# EAGLE design cm3_audio (EAGLE 9.0.1)
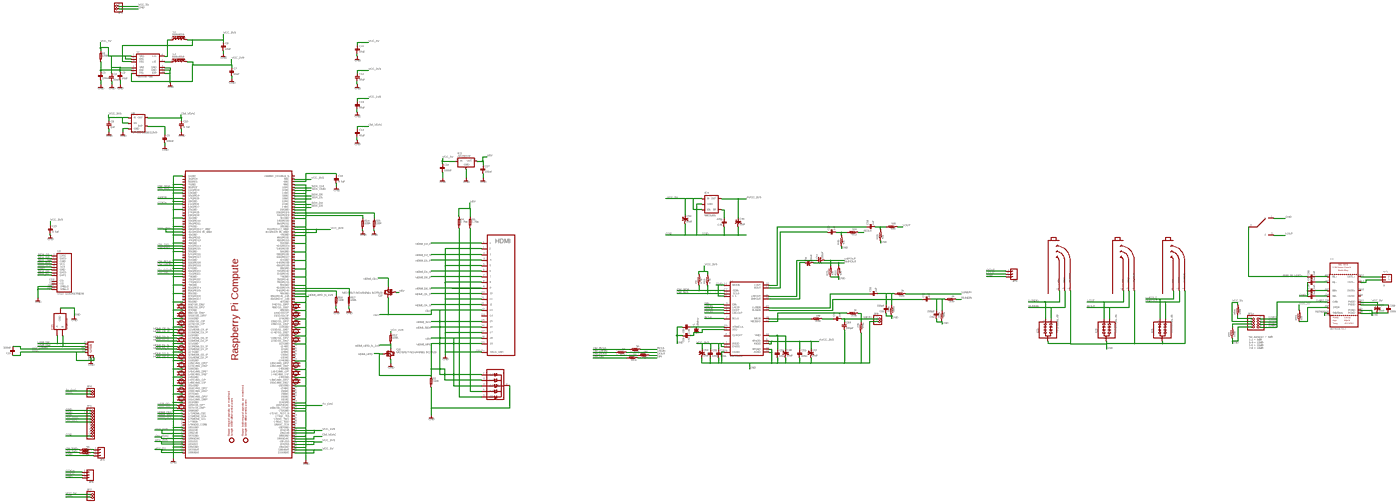
[diagram p0: schematic, sheet 1, overview]
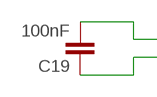
[diagram p1: schematic, sheet 1, part 1 of 4]
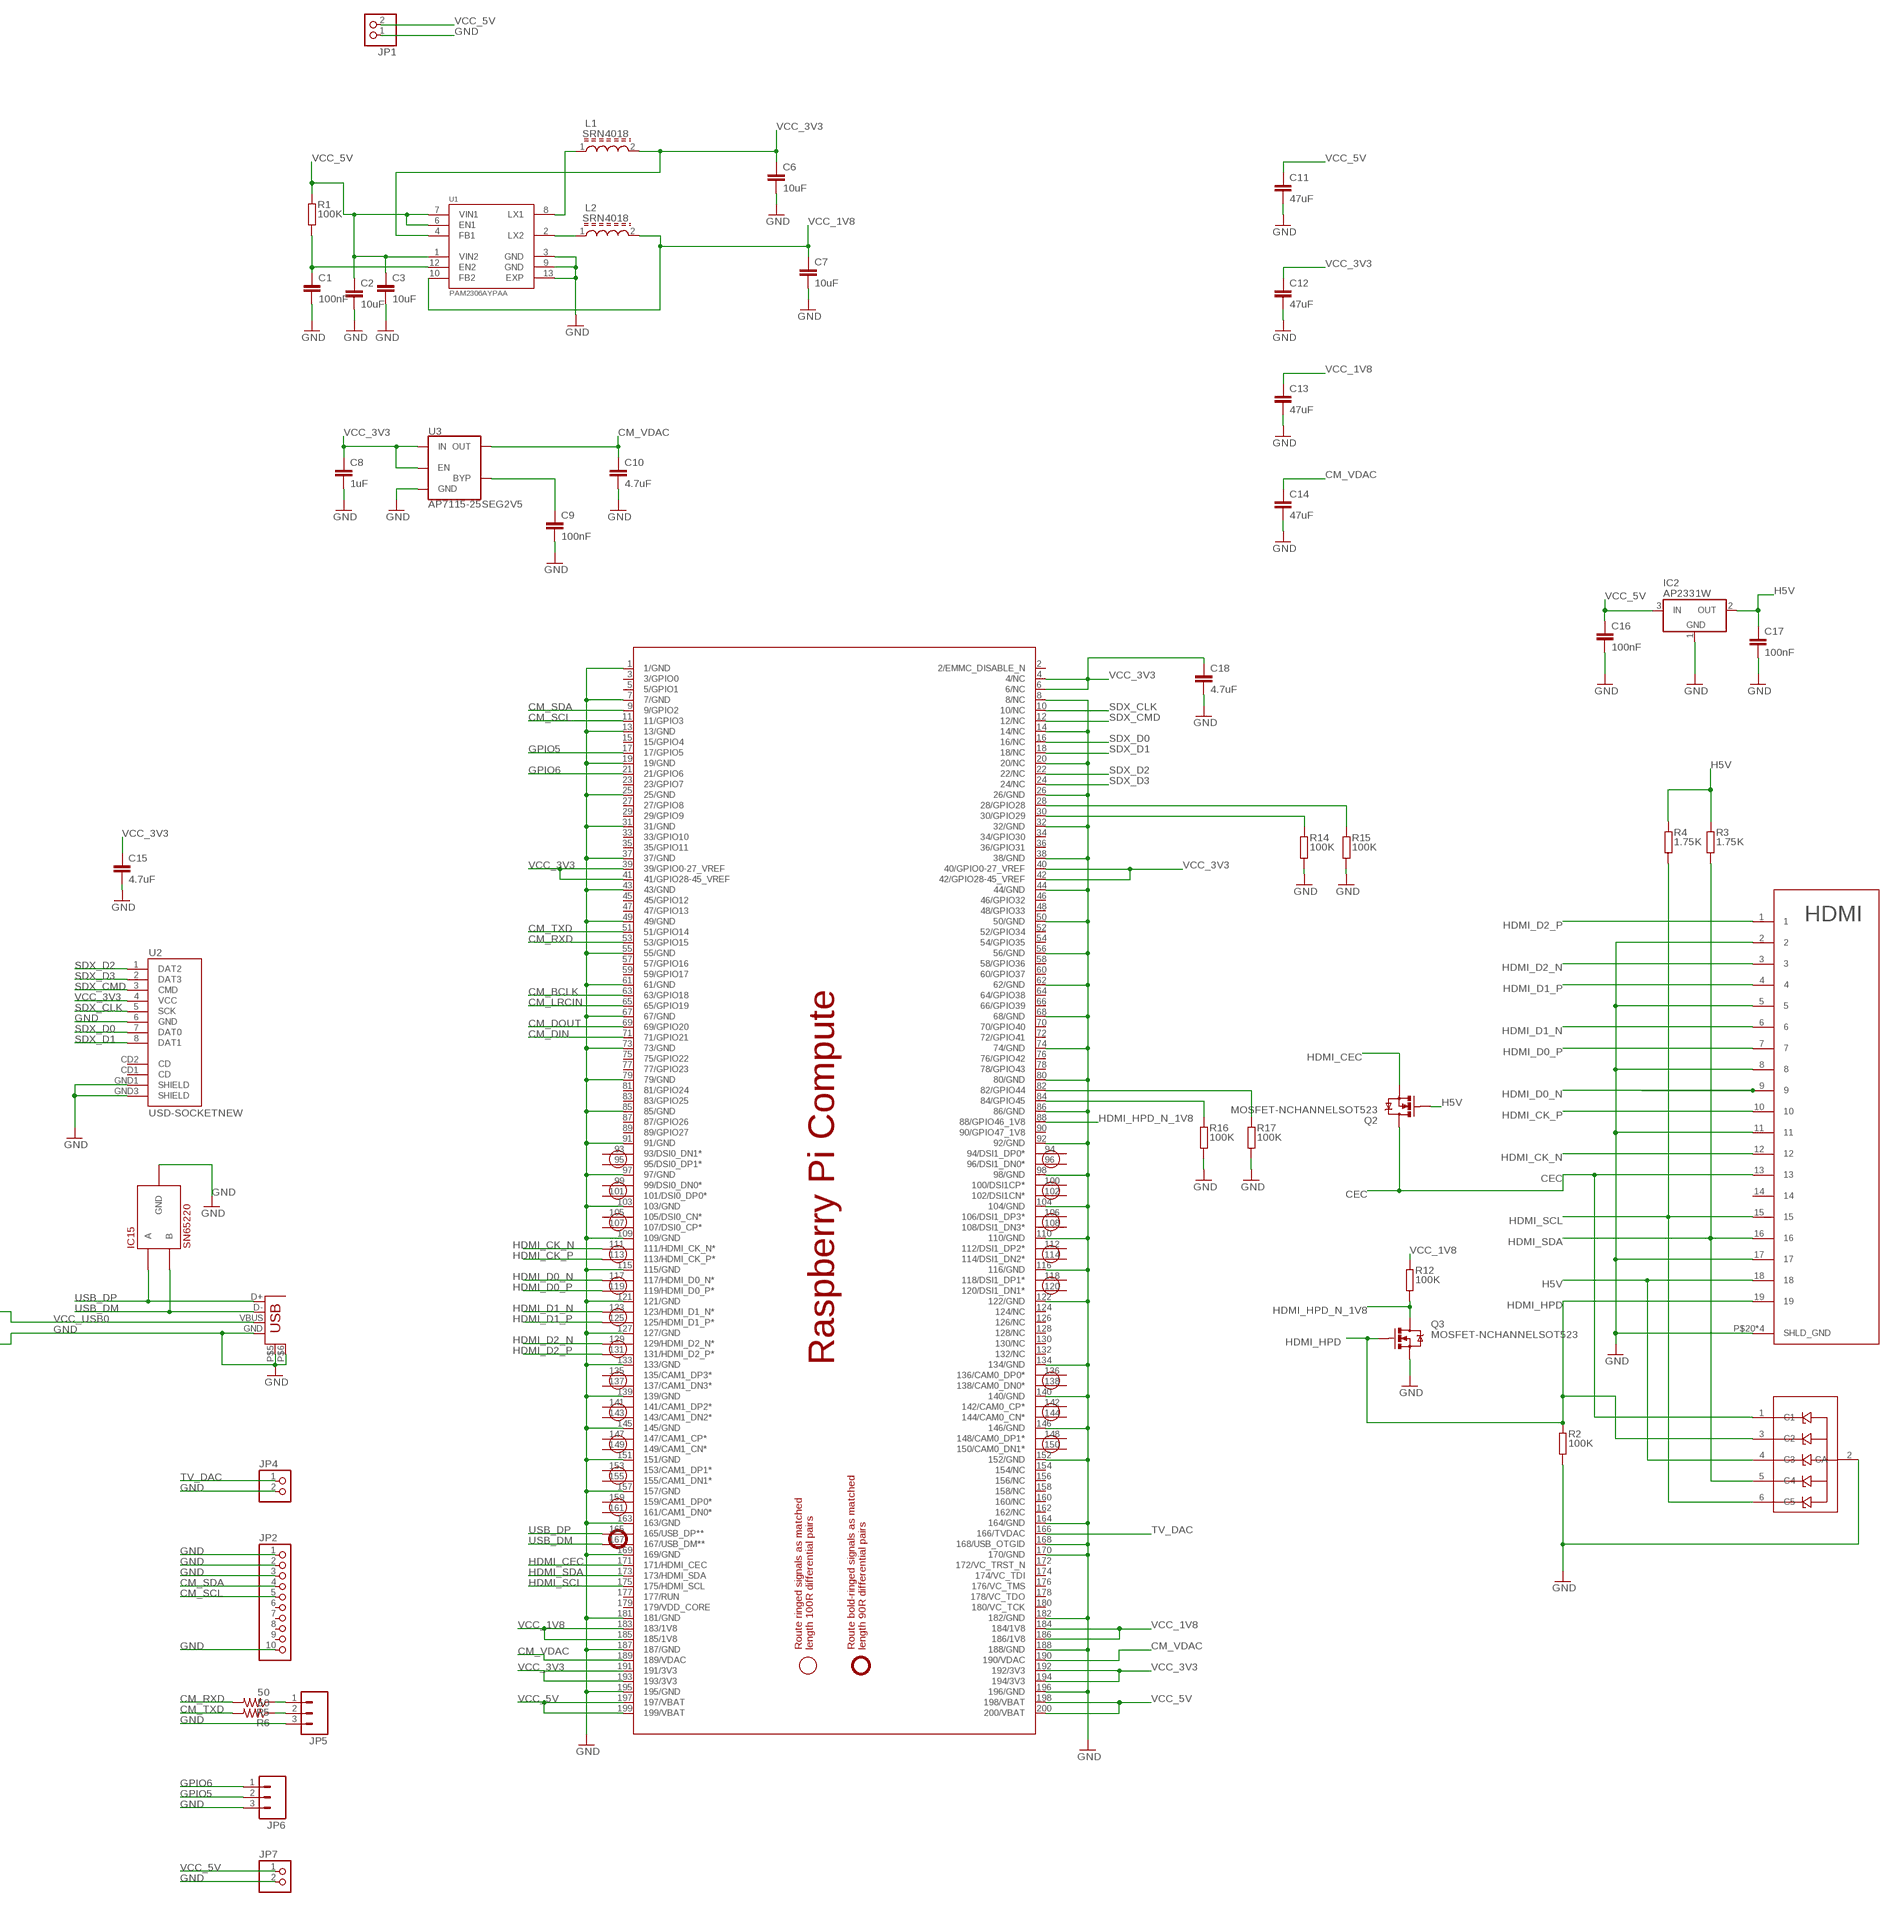
[diagram p2: schematic, sheet 1, part 2 of 4]
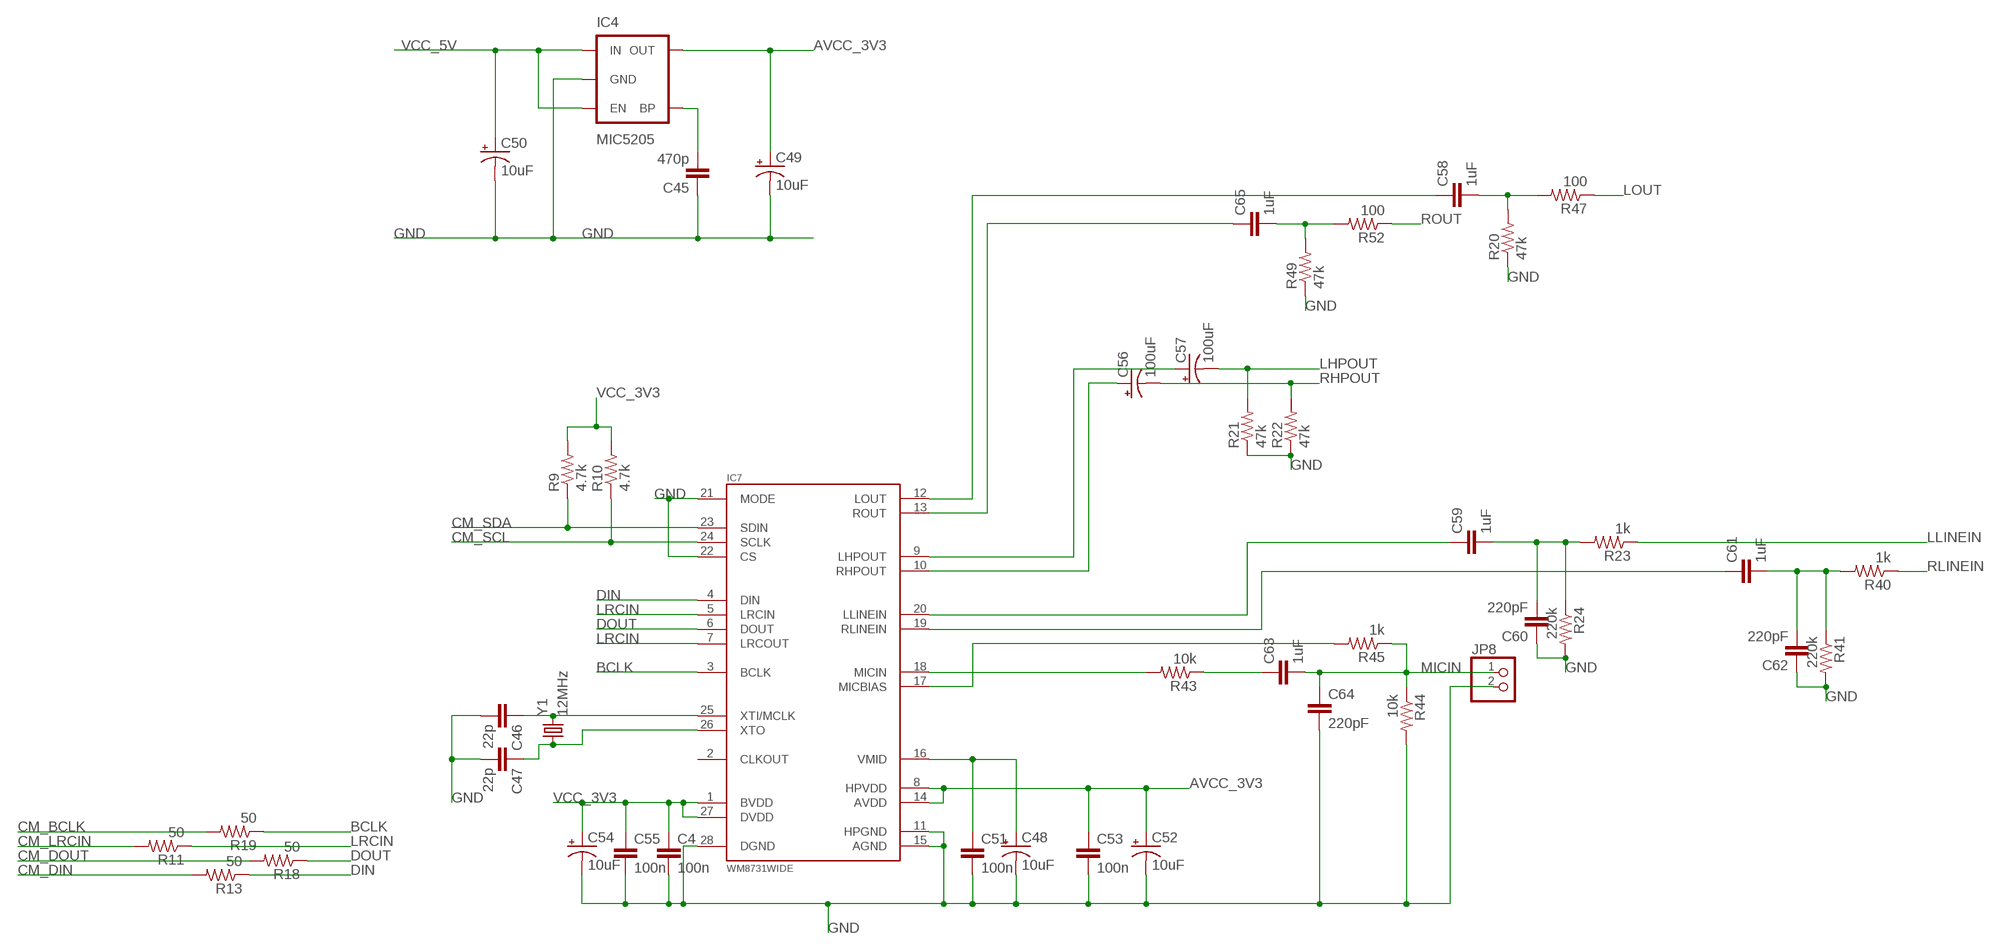
[diagram p3: schematic, sheet 1, part 3 of 4]
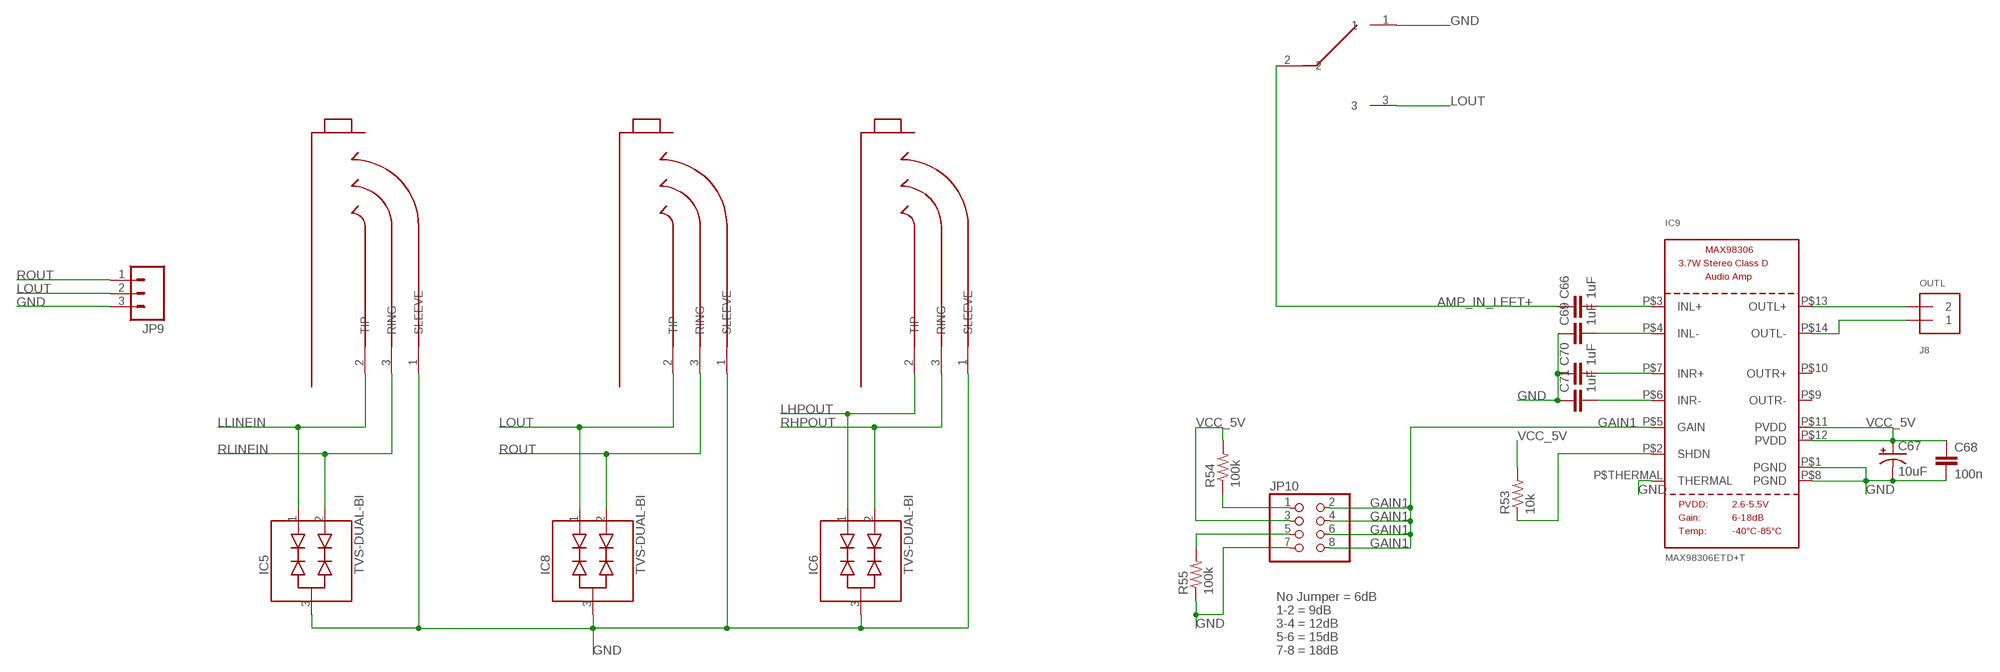
[diagram p4: schematic, sheet 1, part 4 of 4]

## Parts
C1  100nF  C-EUC0603  [C0603]
C2  10uF  C-EUC0805  [C0805]
C3  10uF  C-EUC0805  [C0805]
C4  100n  CAP0603-CAP  [0603-CAP]
C6  10uF  C-EUC0805  [C0805]
C7  10uF  C-EUC0805  [C0805]
C8  1uF  C-EUC0603  [C0603]
C9  100nF  C-EUC0603  [C0603]
C10  4.7uF  C-EUC0603  [C0603]
C11  47uF  C-EUC3216  [C3216]
C12  47uF  C-EUC3216  [C3216]
C13  47uF  C-EUC3216  [C3216]
C14  47uF  C-EUC3216  [C3216]
C15  4.7uF  C-EUC0603  [C0603]
C16  100nF  C-EUC0603  [C0603]
C17  100nF  C-EUC0603  [C0603]
C18  4.7uF  C-EUC1608  [C1608]
C19  100nF  CAP0603-CAP  [0603-CAP]
C45  470p  CAP0603-CAP  [0603-CAP]
C46  22p  CAP0603-CAP  [0603-CAP]
C47  22p  CAP0603-CAP  [0603-CAP]
C48  10uF  CAP_POLB  [PANASONIC_B]
C49  10uF  CAP_POLB  [PANASONIC_B]
C50  10uF  CAP_POLB  [PANASONIC_B]
C51  100n  CAP0603-CAP  [0603-CAP]
C52  10uF  CAP_POLB  [PANASONIC_B]
C53  100n  CAP0603-CAP  [0603-CAP]
C54  10uF  CAP_POLB  [PANASONIC_B]
C55  100n  CAP0603-CAP  [0603-CAP]
C56  100uF  CAP_POLD  [PANASONIC_D]
C57  100uF  CAP_POLD  [PANASONIC_D]
C58  1uF  CAP0603-CAP  [0603-CAP]
C59  1uF  CAP0603-CAP  [0603-CAP]
C60  220pF  CAP0603-CAP  [0603-CAP]
C61  1uF  CAP0603-CAP  [0603-CAP]
C62  220pF  CAP0603-CAP  [0603-CAP]
C63  1uF  CAP0603-CAP  [0603-CAP]
C64  220pF  CAP0603-CAP  [0603-CAP]
C65  1uF  CAP0603-CAP  [0603-CAP]
C66  1uF  CAP0603-CAP  [0603-CAP]
C67  10uF  CAP_POLB  [PANASONIC_B]
C68  100n  CAP0603-CAP  [0603-CAP]
C69  1uF  CAP0603-CAP  [0603-CAP]
C70  1uF  CAP0603-CAP  [0603-CAP]
C71  1uF  CAP0603-CAP  [0603-CAP]
IC1  PESD3V3L5UYSOT363  [SOT363-INFINION]
IC2  AP2331W  AP2331WCB  [SOT23]
IC4  MIC5205  V_REG_LDOSMD  [SPARKFUN-3-2-07_SOT23-5]
IC5  TVS-DUAL-BI  [SOT23]
IC6  TVS-DUAL-BI  [SOT23]
IC7  WM8731WIDE  [SSOP28DB]
IC8  TVS-DUAL-BI  [SOT23]
IC9  MAX98306ETD+T  AUDIOAMP_MAX98306  [TDFN14_3X3MM]
IC15  SN65220  [SOT23-6L]
J1  STEREO_HEADPHONE_NO_SWITCH  [3.5MM-JACK-SJ1-351X-SMT]
J6  STEREO_HEADPHONE_NO_SWITCH  [3.5MM-JACK-SJ1-351X-SMT]
J7  STEREO_HEADPHONE_NO_SWITCH  [3.5MM-JACK-SJ1-351X-SMT]
J8  OUTL  TERMBLOCK_1X2  [TERMBLOCK_1X2-3.5MM]
JP1  PINHD-1X2  [1X02]
JP2  PINHD-1X10  [1X10]
JP3  USB-A  USB-A-SMD  [USB-A-S-NOSILK-FEMALE]
JP4  PINHD-1X2  [1X02]
JP5  M03LOCK_LONGPADS  [1X03_LOCK_LONGPADS]
JP6  M03LOCK_LONGPADS  [1X03_LOCK_LONGPADS]
JP7  PINHD-1X2  [1X02]
JP8  PINHD-1X2  [1X02]
JP9  M03LONGPADS  [1X03_LONGPADS]
JP10  PINHD-2X4  [2X04]
L1  SRN4018  [INDP4040X180N]
L2  SRN4018  [INDP4040X180N]
Q2  MOSFET-NCHANNELSOT523  [SOT523]
Q3  MOSFET-NCHANNELSOT523  [SOT523]
R1  100K  R-EU_R0603  [R0603]
R2  100K  R-EU_R0603  [R0603]
R3  1.75K  R-EU_R0603  [R0603]
R4  1.75K  R-EU_R0603  [R0603]
R5  50  RESISTOR0603-RES  [0603-RES]
R6  50  RESISTOR0603-RES  [0603-RES]
R9  4.7k  RESISTOR0603-RES  [0603-RES]
R10  4.7k  RESISTOR0603-RES  [0603-RES]
R11  50  RESISTOR0603-RES  [0603-RES]
R12  100K  R-EU_R0603  [R0603]
R13  50  RESISTOR0603-RES  [0603-RES]
R14  100K  R-EU_R0603  [R0603]
R15  100K  R-EU_R0603  [R0603]
R16  100K  R-EU_R0603  [R0603]
R17  100K  R-EU_R0603  [R0603]
R18  50  RESISTOR0603-RES  [0603-RES]
R19  50  RESISTOR0603-RES  [0603-RES]
R20  47k  RESISTOR0603-RES  [0603-RES]
R21  47k  RESISTOR0603-RES  [0603-RES]
R22  47k  RESISTOR0603-RES  [0603-RES]
R23  1k  RESISTOR0603-RES  [0603-RES]
R24  220k  RESISTOR0603-RES  [0603-RES]
R40  1k  RESISTOR0603-RES  [0603-RES]
R41  220k  RESISTOR0603-RES  [0603-RES]
R43  10k  RESISTOR0603-RES  [0603-RES]
R44  10k  RESISTOR0603-RES  [0603-RES]
R45  1k  RESISTOR0603-RES  [0603-RES]
R47  100  RESISTOR0603-RES  [0603-RES]
R49  47k  RESISTOR0603-RES  [0603-RES]
R52  100  RESISTOR0603-RES  [0603-RES]
R53  10k  RESISTOR0603-RES  [0603-RES]
R54  100k  RESISTOR0603-RES  [0603-RES]
R55  100k  RESISTOR0603-RES  [0603-RES]
S1  SWITCH_SPDTRA  [SLIDE_SWITCH_TE_RA]
SODIMM  RPI_COMPUTE  [RPI_COMPUTE]
U1  PAM2306AYPAA  [SON45P300X300X80-13N]
U2  USD-SOCKETNEW  [MICRO-SD-SOCKET-PP]
U3  AP7115-25SEG2V5  [SC70]
U4  HDMI  [HDMI]
Y1  12MHz  CRYSTAL5X3  [CRYSTAL-SMD-5X3]

## Nets
AMP_IN_LEFT+: C66.1 S1.2
AVCC_3V3 [power]: C49.+ C52.+ C53.1 IC4.5(OUT) IC7.8(HPVDD) IC7.14(AVDD)
BCLK: IC7.3(BCLK) R19.1
CEC: IC1.1(C1) Q2.3(D) U4.13
CM_BCLK: R19.2 SODIMM.63(63/GPIO18)
CM_DIN: R13.2 SODIMM.71(71/GPIO21)
CM_DOUT: R18.2 SODIMM.69(69/GPIO20)
CM_LRCIN: R11.2 SODIMM.65(65/GPIO19)
CM_RXD: R5.2 SODIMM.53(53/GPIO15)
CM_SCL: IC7.24(SCLK) JP2.5 R10.1 SODIMM.11(11/GPIO3)
CM_SDA: IC7.23(SDIN) JP2.4 R9.1 SODIMM.9(9/GPIO2)
CM_TXD: R6.2 SODIMM.51(51/GPIO14)
CM_VDAC: C10.1 C14.1 SODIMM.189(189/VDAC) SODIMM.190(190/VDAC) U3.5(OUT)
DIN: IC7.4(DIN) R13.1
DOUT: IC7.6(DOUT) R18.1
GAIN1: IC9.P$5(GAIN) JP10.2 JP10.4 JP10.6 JP10.8
GND: C1.2 C2.2 C3.2 C4.2 C6.2 C7.2 C8.2 C9.2 C10.2 C11.2 C12.2 C13.2 C14.2 C15.2 C16.2 C17.2 C18.2 C19.1 C45.1 C46.2 C47.2 C48.- C49.- C50.- C51.2 C52.- C53.2 C54.- C55.2 C60.1 C62.1 C64.2 C67.- C68.2 C69.1 C70.1 C71.1 IC1.2(CA) IC2.1(GND) IC4.2(GND) IC5.3(GND) IC6.3(GND) IC7.11(HPGND) IC7.15(AGND) IC7.21(MODE) IC7.22(CS) IC7.28(DGND) IC8.3(GND) IC9.P$1(PGND) IC9.P$8(PGND) IC9.P$THERMAL(THERMAL) IC15.2(GND) IC15.5(GND) J1.1(SLEEVE) J6.1(SLEEVE) J7.1(SLEEVE) JP1.1 JP2.1 JP2.2 JP2.3 JP2.10 JP3.GND JP3.P$5(SHIELD1) JP3.P$6(SHIELD2) JP4.2 JP5.3 JP6.3 JP7.2 JP8.2 JP9.3 JP10.7 Q3.2(S) R2.1 R14.1 R15.1 R16.1 R17.1 R20.1 R21.1 R22.1 R24.2 R41.2 R44.2 R49.1 R55.1 S1.1 SODIMM.1(1/GND) SODIMM.7(7/GND) SODIMM.8(8/NC) SODIMM.13(13/GND) SODIMM.14(14/NC) SODIMM.19(19/GND) SODIMM.20(20/NC) SODIMM.25(25/GND) SODIMM.26(26/GND) SODIMM.31(31/GND) SODIMM.32(32/GND) SODIMM.37(37/GND) SODIMM.38(38/GND) SODIMM.43(43/GND) SODIMM.44(44/GND) SODIMM.49(49/GND) SODIMM.50(50/GND) SODIMM.55(55/GND) SODIMM.56(56/GND) SODIMM.61(61/GND) SODIMM.62(62/GND) SODIMM.67(67/GND) SODIMM.68(68/GND) SODIMM.73(73/GND) SODIMM.74(74/GND) SODIMM.79(79/GND) SODIMM.80(80/GND) SODIMM.85(85/GND) SODIMM.86(86/GND) SODIMM.91(91/GND) SODIMM.92(92/GND) SODIMM.97(97/GND) SODIMM.98(98/GND) SODIMM.103(103/GND) SODIMM.104(104/GND) SODIMM.109(109/GND) SODIMM.110(110/GND) SODIMM.115(115/GND) SODIMM.116(116/GND) SODIMM.121(121/GND) SODIMM.122(122/GND) SODIMM.127(127/GND) SODIMM.133(133/GND) SODIMM.134(134/GND) SODIMM.139(139/GND) SODIMM.140(140/GND) SODIMM.145(145/GND) SODIMM.146(146/GND) SODIMM.151(151/GND) SODIMM.152(152/GND) SODIMM.157(157/GND) SODIMM.163(163/GND) SODIMM.164(164/GND) SODIMM.168(168/USB_OTGID) SODIMM.169(169/GND) SODIMM.170(170/GND) SODIMM.181(181/GND) SODIMM.182(182/GND) SODIMM.187(187/GND) SODIMM.188(188/GND) SODIMM.195(195/GND) SODIMM.196(196/GND) U1.3(GND) U1.9(GND) U1.13(EXP) U2.6(GND) U2.GND1(SHIELD) U2.GND3(SHIELD) U3.2(GND) U4.2 U4.5 U4.8 U4.11 U4.17 U4.P$20(SHLD_GND) U4.P$21(SHLD_GND) U4.P$22(SHLD_GND) U4.P$23(SHLD_GND)
GPIO5: JP6.2 SODIMM.17(17/GPIO5)
GPIO6: JP6.1 SODIMM.21(21/GPIO6)
H5V: C17.1 IC1.4(C3) IC2.2(OUT) Q2.1(G) R3.2 R4.2 U4.18
HDMI_CEC: Q2.2(S) SODIMM.171(171/HDMI_CEC)
HDMI_CK_N: SODIMM.111(111/HDMI_CK_N*) U4.12
HDMI_CK_P: SODIMM.113(113/HDMI_CK_P*) U4.10
HDMI_D0_N: SODIMM.117(117/HDMI_D0_N*) U4.9
HDMI_D0_P: SODIMM.119(119/HDMI_D0_P*) U4.7
HDMI_D1_N: SODIMM.123(123/HDMI_D1_N*) U4.6
HDMI_D1_P: SODIMM.125(125/HDMI_D1_P*) U4.4
HDMI_D2_N: SODIMM.129(129/HDMI_D2_N*) U4.3
HDMI_D2_P: SODIMM.131(131/HDMI_D2_P*) U4.1
HDMI_HPD: IC1.3(C2) Q3.1(G) R2.2 U4.19
HDMI_HPD_N_1V8: Q3.3(D) R12.1 SODIMM.88(88/GPIO46_1V8)
HDMI_SCL: IC1.6(C5) R4.1 SODIMM.175(175/HDMI_SCL) U4.15
HDMI_SDA: IC1.5(C4) R3.1 SODIMM.173(173/HDMI_SDA) U4.16
LHPOUT: C57.- IC6.1(IO1) J1.2(TIP) R21.2
LLINEIN: IC5.1(IO1) J7.2(TIP) R23.1
LOUT: IC8.1(IO1) J6.2(TIP) JP9.2 R47.1 S1.3
LOUT-1: IC9.P$14(OUTL-) J8.1
LRCIN: IC7.5(LRCIN) IC7.7(LRCOUT) R11.1
MICIN: C63.2 C64.1 JP8.1 R44.1 R45.1
N$1: L1.1 U1.8(LX1)
N$2: C1.1 R1.1 U1.12(EN2)
N$3: JP5.1 R5.1
N$4: JP5.2 R6.1
N$5: L2.1 U1.2(LX2)
N$7: C9.1 U3.4(BYP)
N$8: R16.2 SODIMM.84(84/GPIO45)
N$9: R15.2 SODIMM.28(28/GPIO28)
N$10: R14.2 SODIMM.30(30/GPIO29)
N$11: R17.2 SODIMM.82(82/GPIO44)
N$38: C45.2 IC4.4(BP)
N$39: C46.1 IC7.25(XTI/MCLK) Y1.3
N$40: C47.1 IC7.26(XTO) Y1.1
N$45: C48.+ C51.1 IC7.16(VMID)
N$46: C59.2 C60.2 R23.2 R24.1
N$47: C58.1 IC7.12(LOUT)
N$48: C57.+ IC7.9(LHPOUT)
N$49: C56.+ IC7.10(RHPOUT)
N$50: C61.2 C62.2 R40.2 R41.1
N$51: C59.1 IC7.20(LLINEIN)
N$52: C61.1 IC7.19(RLINEIN)
N$53: IC7.18(MICIN) R43.2
N$54: C63.1 R43.1
N$55: IC7.17(MICBIAS) R45.2
N$58: C58.2 R20.2 R47.2
N$59: C65.2 R49.2 R52.2
N$60: C65.1 IC7.13(ROUT)
N$61: JP10.1 R54.1
N$62: JP10.5 R55.2
N$63: C66.2 IC9.P$3(INL+)
N$64: IC9.P$13(OUTL+) J8.2
N$65: IC9.P$2(SHDN) R53.1
N$66: C69.2 IC9.P$4(INL-)
N$67: C70.2 IC9.P$7(INR+)
N$68: C71.2 IC9.P$6(INR-)
RHPOUT: C56.- IC6.2(IO2) J1.3(RING) R22.2
RLINEIN: IC5.2(IO2) J7.3(RING) R40.1
ROUT: IC8.2(IO2) J6.3(RING) JP9.1 R52.1
SDX_CLK: SODIMM.10(10/NC) U2.5(SCK)
SDX_CMD: SODIMM.12(12/NC) U2.3(CMD)
SDX_D0: SODIMM.16(16/NC) U2.7(DAT0)
SDX_D1: SODIMM.18(18/NC) U2.8(DAT1)
SDX_D2: SODIMM.22(22/NC) U2.1(DAT2)
SDX_D3: SODIMM.24(24/NC) U2.2(DAT3)
TV_DAC: JP4.1 SODIMM.166(166/TVDAC)
USB_DM: IC15.4(B) JP3.D- SODIMM.167(167/USB_DM**)
USB_DP: IC15.6(A) JP3.D+ SODIMM.165(165/USB_DP**)
VCC_1V8: C7.1 C13.1 L2.2 R12.2 SODIMM.183(183/1V8) SODIMM.184(184/1V8) SODIMM.185(185/1V8) SODIMM.186(186/1V8) U1.10(FB2)
VCC_3V3: C4.1 C6.1 C8.1 C12.1 C15.1 C18.1 C54.+ C55.1 IC7.1(BVDD) IC7.27(DVDD) L1.2 R9.2 R10.2 SODIMM.4(4/NC) SODIMM.6(6/NC) SODIMM.39(39/GPIO0-27_VREF) SODIMM.40(40/GPIO0-27_VREF) SODIMM.41(41/GPIO28-45_VREF) SODIMM.42(42/GPIO28-45_VREF) SODIMM.191(191/3V3) SODIMM.192(192/3V3) SODIMM.193(193/3V3) SODIMM.194(194/3V3) U1.4(FB1) U2.4(VCC) U3.1(IN) U3.3(EN)
VCC_5V: C2.1 C3.1 C11.1 C16.1 C50.+ C67.+ C68.1 IC2.3(IN) IC4.1(IN) IC4.3(EN) IC9.P$11(PVDD) IC9.P$12(PVDD) JP1.2 JP7.1 JP10.3 R1.2 R53.2 R54.2 SODIMM.197(197/VBAT) SODIMM.198(198/VBAT) SODIMM.199(199/VBAT) SODIMM.200(200/VBAT) U1.1(VIN2) U1.6(EN1) U1.7(VIN1)
VCC_USB0: C19.2 JP3.VBUS
Unconnected: IC7.2(CLKOUT) IC9.P$9(OUTR-) IC9.P$10(OUTR+) JP2.6 JP2.7 JP2.8 JP2.9 SODIMM.2(2/EMMC_DISABLE_N) SODIMM.3(3/GPIO0) SODIMM.5(5/GPIO1) SODIMM.15(15/GPIO4) SODIMM.23(23/GPIO7) SODIMM.27(27/GPIO8) SODIMM.29(29/GPIO9) SODIMM.33(33/GPIO10) SODIMM.34(34/GPIO30) SODIMM.35(35/GPIO11) SODIMM.36(36/GPIO31) SODIMM.45(45/GPIO12) SODIMM.46(46/GPIO32) SODIMM.47(47/GPIO13) SODIMM.48(48/GPIO33) SODIMM.52(52/GPIO34) SODIMM.54(54/GPIO35) SODIMM.57(57/GPIO16) SODIMM.58(58/GPIO36) SODIMM.59(59/GPIO17) SODIMM.60(60/GPIO37) SODIMM.64(64/GPIO38) SODIMM.66(66/GPIO39) SODIMM.70(70/GPIO40) SODIMM.72(72/GPIO41) SODIMM.75(75/GPIO22) SODIMM.76(76/GPIO42) SODIMM.77(77/GPIO23) SODIMM.78(78/GPIO43) SODIMM.81(81/GPIO24) SODIMM.83(83/GPIO25) SODIMM.87(87/GPIO26) SODIMM.89(89/GPIO27) SODIMM.90(90/GPIO47_1V8) SODIMM.93(93/DSI0_DN1*) SODIMM.94(94/DSI1_DP0*) SODIMM.95(95/DSI0_DP1*) SODIMM.96(96/DSI1_DN0*) SODIMM.99(99/DSI0_DN0*) SODIMM.100(100/DSI1CP*) SODIMM.101(101/DSI0_DP0*) SODIMM.102(102/DSI1CN*) SODIMM.105(105/DSI0_CN*) SODIMM.106(106/DSI1_DP3*) SODIMM.107(107/DSI0_CP*) SODIMM.108(108/DSI1_DN3*) SODIMM.112(112/DSI1_DP2*) SODIMM.114(114/DSI1_DN2*) SODIMM.118(118/DSI1_DP1*) SODIMM.120(120/DSI1_DN1*) SODIMM.124(124/NC) SODIMM.126(126/NC) SODIMM.128(128/NC) SODIMM.130(130/NC) SODIMM.132(132/NC) SODIMM.135(135/CAM1_DP3*) SODIMM.136(136/CAM0_DP0*) SODIMM.137(137/CAM1_DN3*) SODIMM.138(138/CAM0_DN0*) SODIMM.141(141/CAM1_DP2*) SODIMM.142(142/CAM0_CP*) SODIMM.143(143/CAM1_DN2*) SODIMM.144(144/CAM0_CN*) SODIMM.147(147/CAM1_CP*) SODIMM.148(148/CAM0_DP1*) SODIMM.149(149/CAM1_CN*) SODIMM.150(150/CAM0_DN1*) SODIMM.153(153/CAM1_DP1*) SODIMM.154(154/NC) SODIMM.155(155/CAM1_DN1*) SODIMM.156(156/NC) SODIMM.158(158/NC) SODIMM.159(159/CAM1_DP0*) SODIMM.160(160/NC) SODIMM.161(161/CAM1_DN0*) SODIMM.162(162/NC) SODIMM.172(172/VC_TRST_N) SODIMM.174(174/VC_TDI) SODIMM.176(176/VC_TMS) SODIMM.177(177/RUN) SODIMM.178(178/VC_TDO) SODIMM.179(179/VDD_CORE) SODIMM.180(180/VC_TCK) U2.CD1(CD) U2.CD2(CD) U4.14

## Notes on the sheet
- No Jumper = 6dB
- 1-2 = 9dB
- 3-4 = 12dB
- 5-6 = 15dB
- 7-8 = 18dB

## Library data of the parts
C1 C9 C16 C17 = rcl:C-EU: CAPACITOR, European symbol; CID: 67; SPICEPREFIX: C
C2 C3 C6 C7 = rcl:C-EU: CAPACITOR, European symbol; CID: 351; SPICEPREFIX: C
C4 C19 C51 C53 C55 C68 = osborn:CAP: Capacitor Standard 0603 ceramic capacitor, and 0.1" leaded capacitor.; CID: 67
C8 = rcl:C-EU: CAPACITOR, European symbol; CID: 73; SPICEPREFIX: C
C10 C15 C18 = rcl:C-EU: CAPACITOR, European symbol; CID: 353; SPICEPREFIX: C
C11-C14 = rcl:C-EU: CAPACITOR, European symbol; CID: 355; SPICEPREFIX: C
C45 = osborn:CAP: Capacitor Standard 0603 ceramic capacitor, and 0.1" leaded capacitor.; CID: 111
C46 C47 = osborn:CAP: Capacitor Standard 0603 ceramic capacitor, and 0.1" leaded capacitor.; CID: 106
C48-C50 C52 C54 C67 = osborn:CAP_POL: Capacitor Polarized These are standard SMD and PTH capacitors. Normally 10uF, 47uF, and 100uF in electrolytic and tantalum varieties. Always verify the external diameter of the through hole cap, it varies with capacity, voltage, and manufacturer. The EIA devices should be standard.; CID: 340
C56 C57 = SparkFun-20110623:CAP_POL: Capacitor Polarized These are standard SMD and PTH capacitors. Normally 10uF, 47uF, and 100uF in electrolytic and tantalum varieties. Always verify the external diameter of the through hole cap, it varies with capacity, voltage, and manufacturer. The EIA devices should be standard.; CID: 68
C58 C59 C61 C63 C65 C66 C69-C71 = osborn:CAP: Capacitor Standard 0603 ceramic capacitor, and 0.1" leaded capacitor.; CID: 73
C60 C62 C64 = osborn:CAP: Capacitor Standard 0603 ceramic capacitor, and 0.1" leaded capacitor.; CID: 345
IC1 = osborn:PESD3V3L5UY; CID: 360
IC2 = AP2331W:AP2331W: AP2331W 0.2A SINGLE CHANNEL CURRENT-LIMITED LOAD SWITCH; CID: 358
IC4 = osborn:V_REG_LDO: Voltage Regulator LDO Standard 150mA LDO voltage regulator in SOT-23 layout. Micrel part MIC5205. BP (by-pass) pin is used to lower output noise with 470pF cap.; CID: 146
IC5 IC6 IC8 = osborn:TVS-DUAL-BI; CID: 313
IC7 = osborn:WM8731; CID: 333
IC9 = microbuilder:AUDIOAMP_MAX98306: MAX98306 3.7W Stereo Audio Amp - TDFN14 3.7W @ 3 ohm, 2.6-5.5V supply, 6-18dB selectable gain; CID: 347
IC15 = osborn:SN65220; CID: 314
J1 J6 J7 = osborn:STEREO_HEADPHONE_NO_SWITCH; CID: 284
J8 = microbuilder:TERMBLOCK_1X2: 3.5mm Terminal block http://www.ladyada.net/library/pcb/eaglelibrary.html
JP1 JP4 JP7 = osborn:PINHD-1X2: PIN HEADER
JP2 = pinhead:PINHD-1X10: PIN HEADER
JP3 = osborn:USB: USB Connectors USB-B-PTH is fully proven SKU : PRT-00139/CONN-08278 USB-miniB is fully proven SKU : PRT-00587 USB-A-PCB is untested. USB-A-H is throughly reviewed, but untested. Spark Fun Electronics SKU : PRT-00437 USB-B-SMT is throughly reviewed, but untested. Needs silkscreen touching up. USB-A-S has not been used/tested USB-MB-H has not been used/tested USB-MICROB has been used. CONN-09505; CID: 181; PROD_ID: CONN-09520
JP5 JP6 JP9 = osborn:M03: Header 3 Standard 3-pin 0.1" header. Use with straight break away headers (SKU : PRT-00116), right angle break away headers (PRT-00553), swiss pins (PRT-00743), machine pins (PRT-00117), and female headers (PRT-00115). Molex polarized connector foot print use with SKU : PRT-08232 with associated crimp pins and housings.
JP8 = pinhead:PINHD-1X2: PIN HEADER
JP10 = adafruit:PINHD-2X4: PIN HEADER
L1 L2 = SRN4018:SRN4018: Inductor Power Semi-Shielded Wirewound; CID: 352
Q2 Q3 = osborn:MOSFET-NCHANNEL: Common NMOSFET Parts MFG P/N Store ID Prod ID FDD8780 TRANS-09984 SI7820DN TRANS-11055 FDS6630A IC-08089 2N7002PW TRANS-11151 FQP30N06L COM-10213 TRANS-10060 BSS123LT1G TRANS-08345 BSS138 TRANS-00830 BS170 2N7000; CID: 359
R1 R2 R12 R14-R17 = rcl:R-EU_: RESISTOR, European symbol; CID: 157; SPICEPREFIX: R
R3 R4 = rcl:R-EU_: RESISTOR, European symbol; CID: 357; SPICEPREFIX: R
R5 R6 R11 R13 R18 R19 = osborn:RESISTOR: Resistor Basic schematic elements and footprints for 0603, 1206, and PTH resistors.; CID: 343; SUPPLIER: none
R9 R10 = osborn:RESISTOR: Resistor Basic schematic elements and footprints for 0603, 1206, and PTH resistors.; CID: 78; SUPPLIER: none
R20-R22 R49 = osborn:RESISTOR: Resistor Basic schematic elements and footprints for 0603, 1206, and PTH resistors.; CID: 236; SUPPLIER: none
R23 R40 R45 = osborn:RESISTOR: Resistor Basic schematic elements and footprints for 0603, 1206, and PTH resistors.; CID: 102; SUPPLIER: none
R24 R41 = osborn:RESISTOR: Resistor Basic schematic elements and footprints for 0603, 1206, and PTH resistors.; CID: 344; SUPPLIER: none
R43 R44 R53 = osborn:RESISTOR: Resistor Basic schematic elements and footprints for 0603, 1206, and PTH resistors.; CID: 69; SUPPLIER: none
R47 R52 = osborn:RESISTOR: Resistor Basic schematic elements and footprints for 0603, 1206, and PTH resistors.; CID: 342; SUPPLIER: none
R54 R55 = osborn:RESISTOR: Resistor Basic schematic elements and footprints for 0603, 1206, and PTH resistors.; CID: 157; SUPPLIER: none
S1 = osborn:SWITCH_SPDT
SODIMM = e14_Rpi_Compute_RevC:RPI_COMPUTE: Device for a Raspberry PI Compute module. Note that the package is for a DDR2 connector of 'standard' orientation. Example: TE Connectivity P/N: 1565917-4, Newark P/N: 08P0616, Farnell P/N: 2112525 More information is available at http://www.element14.com/community/community/raspberry-pi/raspberry-pi-compute-module; CID: 356
U1 = PAM2306AYPAA:PAM2306AYPAA: PAM2306 Series 5.5V 1A Dual High Efficiency PWM Step Down DC-DC Converter-WDFN12; AVAILABILITY: Good; CID: 362; DESCRIPTION: IC REG BUCK ADJ 1A DL SYNC 12DFN; MF: Diodes Inc.; MP: PAM2306AYPAA; PACKAGE: WFDFN-12 Diodes Inc.; PRICE: 0.33 USD
U2 = osborn:USD-SOCKET: microSD Socket Push-push type uSD socket. Schematic element and footprint production proven. Spark Fun Electronics SKU : PRT-00127. tDoc lines correctly indicate media card edge positions when inserting (unlocked, locked, depressed).; CID: 182
U3 = AP7115-25SEG:AP7115-25SEG: AP7115-25SEG 150mA LOW DROPOUT LINEAR REGULATOR WITH SHUTDOWN; CID: 354
U4 = 00_cody:HDMI; CID: 361
Y1 = osborn:CRYSTAL: Crystals Various standard crystals. Proven footprints. Spark Fun Electronics SKU : COM-00534; CID: 339

## Net classes
1 power: width 0.508 mm

## Board
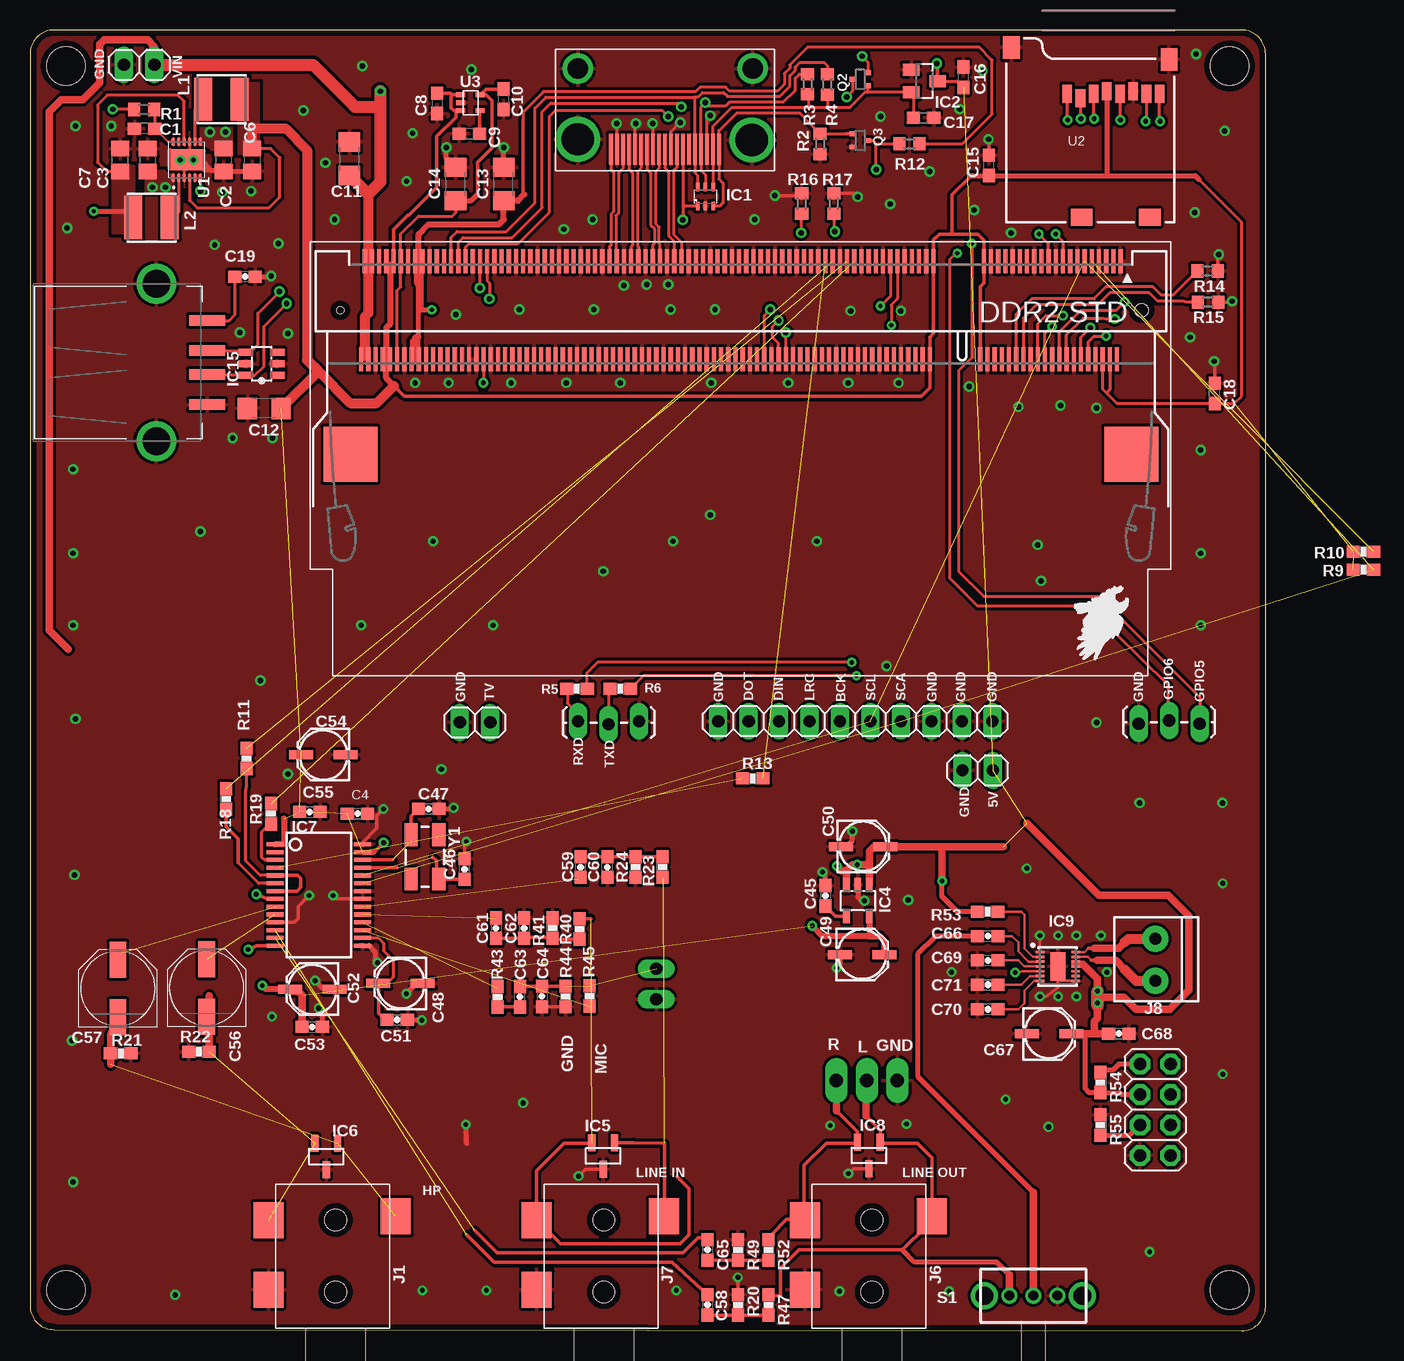
[diagram p5: board, top side]
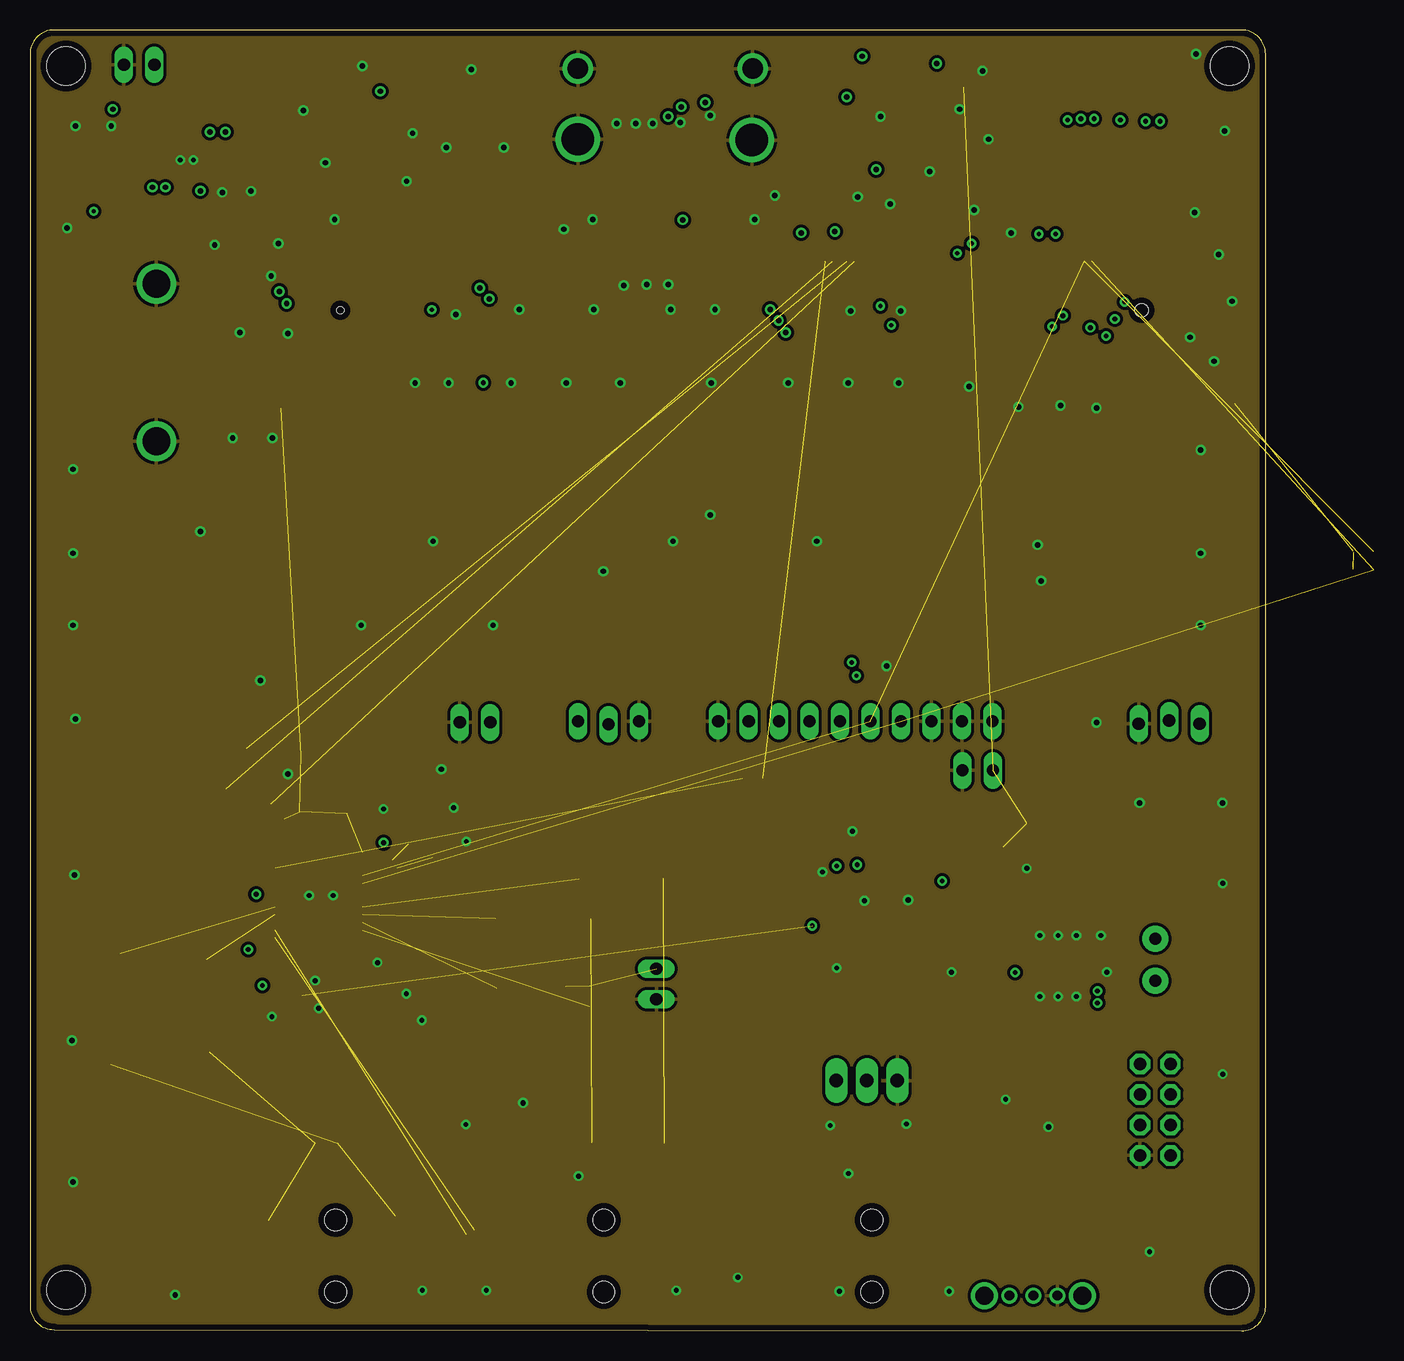
[diagram p6: board, inner layer Route2]
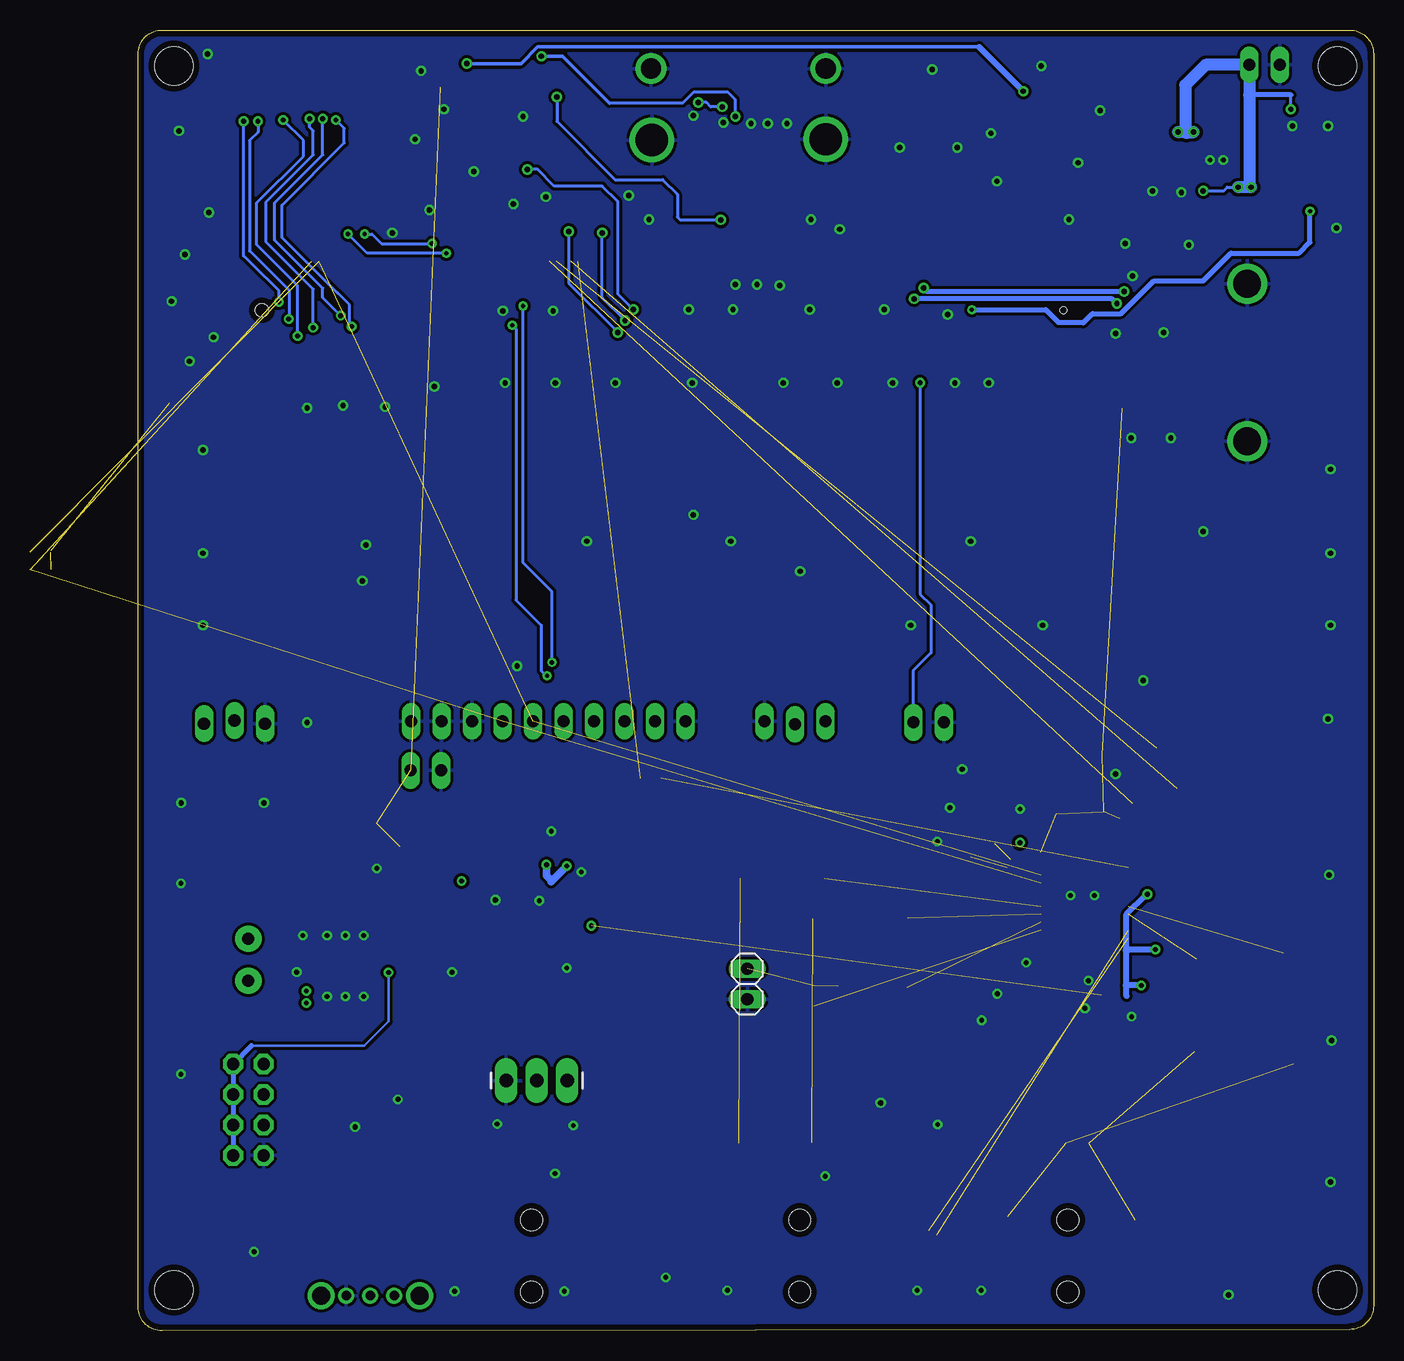
[diagram p7: board, bottom side, seen from below]

Size 103 x 108.4 mm. Coordinates in mm from the lower left corner, seen from the top.
Outline: 103,2 103,106.4 arc90 101,108.4 2,108.4 arc90 0,106.4 0,2.1 arc90 2,0.1 101,0 arc90 103,2
Copper layers (1*2+15*16): Top 0.035mm / dielectric 1.5mm / Route2 0.035mm / dielectric 0.15mm / Route15 0.035mm / dielectric 0.2mm / Bottom 0.035mm
Design rules "default *": minimum track width 6mil, minimum drill 0.35mm, track to track 8mil, track to pad 6mil, pad to pad 6mil, via to via 8mil, smd to smd 6mil, copper to edge 20mil, drill to drill 6mil, minimum pad ring 10mil, minimum via ring 8mil, stop-mask expansion 4mil, vias tented up to drill 0mil, thermal gap 10mil
Holes 3.17 mm at 3,3.4 3,105.4 100,105.4 100,3.4

### Footprints (pad centres in the part's own frame; a part is rotated, then mirrored left to right if it is on the bottom)
C0603 = smd 1.1 x 1: 1 -0.85,0; 2 0.85,0
C0805 = smd 1.3 x 1.5: 1 -0.95,0; 2 0.95,0
0603-CAP = smd 1.1 x 1: 1 -0.85,0; 2 0.85,0
C3216 = smd 1.6 x 1.8: 1 -1.4,0; 2 1.4,0
C1608 = smd 1.1 x 1: 1 -0.85,0; 2 0.85,0
PANASONIC_B = smd 2 x 0.75: + 1.875,-0.022; - -1.825,-0.022
PANASONIC_D = smd 3 x 1.4: + 2.4,0; - -2.4,0
SOT363-INFINION = smd 0.3 x 0.7: 1 -0.65,-0.8; 2 0,-0.8; 3 0.65,-0.8; 4 0.65,0.8; 5 0,0.8; 6 -0.65,0.8
SOT23 = smd 1 x 1.4: 1 -0.95,-1.1; 2 0.95,-1.1; 3 0,1.1
SPARKFUN-3-2-07_SOT23-5 = smd 0.55 x 1.2: 1 -0.95,-1.3; 2 0,-1.3; 3 0.95,-1.3; 4 0.95,1.3; 5 -0.95,1.3
SOT23' = smd 0.6 x 1.4: 1 -0.95,-1.1; 2 0.95,-1.1; 3 0,1.1
SSOP28DB = smd 0.348 x 1.397: 1 -4.225,-3.656; 2 -3.575,-3.656; 3 -2.925,-3.656; 4 -2.275,-3.656; 5 -1.625,-3.656; 6 -0.975,-3.656; 7 -0.325,-3.656; 8 0.325,-3.656; 9 0.975,-3.656; 10 1.625,-3.656; 11 2.275,-3.656; 12 2.925,-3.656; 13 3.575,-3.656; 14 4.225,-3.656; 15 4.225,3.656; 16 3.575,3.656; 17 2.925,3.656; 18 2.275,3.656; 19 1.625,3.656; 20 0.975,3.656; 21 0.325,3.656; 22 -0.325,3.656; 23 -0.975,3.656; 24 -1.625,3.656; 25 -2.275,3.656; 26 -2.925,3.656; 27 -3.575,3.656; 28 -4.225,3.656
TDFN14_3X3MM = smd 0.7 x 0.2: P$1 -1.475,1.2; P$2 -1.475,0.8; P$3 -1.475,0.4; P$4 -1.475,0; P$5 -1.475,-0.4; P$6 -1.475,-0.8; P$7 -1.475,-1.2; P$8 1.475,-1.2; P$9 1.475,-0.8; P$10 1.475,-0.4; P$11 1.475,0; P$12 1.475,0.4; P$13 1.475,0.8; P$14 1.475,1.2 | smd 1.27 x 2.35: P$THERMAL 0,0
SOT23-6L = smd 0.6 x 1.2: 1 -0.95,-1.3; 2 0,-1.3; 3 0.95,-1.3; 4 0.95,1.3; 5 0,1.3; 6 -0.95,1.3
3.5MM-JACK-SJ1-351X-SMT = smd 3 x 2.5: 1 -2.8,5.6; 2 3.3,-5; 3 3,5.6 | hole 1.8: -3,0; 3,0
TERMBLOCK_1X2-3.5MM = drill 1 pad 2.184: 1 1.8,0; 2 -1.7,0
1X02 = drill 1.016 long: 1 -1.27,0; 2 1.27,0
1X10 = drill 1.016 long: 1 -11.43,0; 2 -8.89,0; 3 -6.35,0; 4 -3.81,0; 5 -1.27,0; 6 1.27,0; 7 3.81,0; 8 6.35,0; 9 8.89,0; 10 11.43,0
USB-A-S-NOSILK-FEMALE = smd 3 x 0.9: D+ 4.212,-1; D- 4.212,1; GND 4.212,-3.5; VBUS 4.212,3.5 | drill 2.311: P$5 0,-6.566; P$6 0,6.566
1X03_LOCK_LONGPADS = drill 1.016 long: 1 0,0; 2 2.54,-0.254; 3 5.08,0
1X03_LONGPADS = drill 1.118 pad 1.88 long: 1 0,0; 2 2.54,0; 3 5.08,0
2X04 = drill 1.016 pad 1.676 octagon: 1 -3.81,-1.27; 2 -3.81,1.27; 3 -1.27,-1.27; 4 -1.27,1.27; 5 1.27,-1.27; 6 1.27,1.27; 7 3.81,-1.27; 8 3.81,1.27
INDP4040X180N = smd 1.5 x 3.6: 1 -1.525,0; 2 1.525,0
SOT523 = smd 0.4 x 0.5: 1 -0.55,-0.65; 2 0.55,-0.65; 3 0,0.65
R0603 = smd 1 x 1.1: 1 -0.85,0; 2 0.85,0
0603-RES = smd 1.1 x 1: 1 -0.85,0; 2 0.85,0
SLIDE_SWITCH_TE_RA = drill 0.8: 1 -2,0; 2 0,0; 3 2,0 | drill 1.5: M1 -4.1,0; M2 4.1,0
RPI_COMPUTE = smd 0.35 x 2: 1 -31.38,-4.1; 2 -31.08,4.1; 3 -30.78,-4.1; 4 -30.48,4.1; 5 -30.18,-4.1; 6 -29.88,4.1; 7 -29.58,-4.1; 8 -29.28,4.1; 9 -28.98,-4.1; 10 -28.68,4.1; 11 -28.38,-4.1; 12 -28.08,4.1; 13 -27.78,-4.1; 14 -27.48,4.1; 15 -27.18,-4.1; 16 -26.88,4.1; 17 -26.58,-4.1; 18 -26.28,4.1; 19 -25.98,-4.1; 20 -25.68,4.1; 21 -25.38,-4.1; 22 -25.08,4.1; 23 -24.78,-4.1; 24 -24.48,4.1; 25 -24.18,-4.1; 26 -23.88,4.1; 27 -23.58,-4.1; 28 -23.28,4.1; 29 -22.98,-4.1; 30 -22.68,4.1; 31 -22.38,-4.1; 32 -22.08,4.1; 33 -21.78,-4.1; 34 -21.48,4.1; 35 -21.18,-4.1; 36 -20.88,4.1; 37 -20.58,-4.1; 38 -20.28,4.1; 39 -19.98,-4.1; 40 -19.68,4.1; 41 -15.78,-4.1; 42 -15.48,4.1; 43 -15.18,-4.1; 44 -14.88,4.1; 45 -14.58,-4.1; 46 -14.28,4.1; 47 -13.98,-4.1; 48 -13.68,4.1; 49 -13.38,-4.1; 50 -13.08,4.1; 51 -12.78,-4.1; 52 -12.48,4.1; 53 -12.18,-4.1; 54 -11.88,4.1; 55 -11.58,-4.1; 56 -11.28,4.1; 57 -10.98,-4.1; 58 -10.68,4.1; 59 -10.38,-4.1; 60 -10.08,4.1; 61 -9.78,-4.1; 62 -9.48,4.1; 63 -9.18,-4.1; 64 -8.88,4.1; 65 -8.58,-4.1; 66 -8.28,4.1; 67 -7.98,-4.1; 68 -7.68,4.1; 69 -7.38,-4.1; 70 -7.08,4.1; 71 -6.78,-4.1; 72 -6.48,4.1; 73 -6.18,-4.1; 74 -5.88,4.1; 75 -5.58,-4.1; 76 -5.28,4.1; 77 -4.98,-4.1; 78 -4.68,4.1; 79 -4.38,-4.1; 80 -4.08,4.1; 81 -3.78,-4.1; 82 -3.48,4.1; 83 -3.18,-4.1; 84 -2.88,4.1; 85 -2.58,-4.1; 86 -2.28,4.1; 87 -1.98,-4.1; 88 -1.68,4.1; 89 -1.38,-4.1; 90 -1.08,4.1; 91 -0.78,-4.1; 92 -0.48,4.1; 93 -0.18,-4.1; 94 0.12,4.1; 95 0.42,-4.1; 96 0.72,4.1; 97 1.02,-4.1; 98 1.32,4.1; 99 1.62,-4.1; 100 1.92,4.1; 101 2.22,-4.1; 102 2.52,4.1; 103 2.82,-4.1; 104 3.12,4.1; 105 3.42,-4.1; 106 3.72,4.1; 107 4.02,-4.1; 108 4.32,4.1; 109 4.62,-4.1; 110 4.92,4.1; 111 5.22,-4.1; 112 5.52,4.1; 113 5.82,-4.1; 114 6.12,4.1; 115 6.42,-4.1; 116 6.72,4.1; 117 7.02,-4.1; 118 7.32,4.1; 119 7.62,-4.1; 120 7.92,4.1; 121 8.22,-4.1; 122 8.52,4.1; 123 8.82,-4.1; 124 9.12,4.1; 125 9.42,-4.1; 126 9.72,4.1; 127 10.02,-4.1; 128 10.32,4.1; 129 10.62,-4.1; 130 10.92,4.1; 131 11.22,-4.1; 132 11.52,4.1; 133 11.82,-4.1; 134 12.12,4.1; 135 12.42,-4.1; 136 12.72,4.1; 137 13.02,-4.1; 138 13.32,4.1; 139 13.62,-4.1; 140 13.92,4.1; 141 14.22,-4.1; 142 14.52,4.1; 143 14.82,-4.1; 144 15.12,4.1; 145 15.42,-4.1; 146 15.72,4.1; 147 16.02,-4.1; 148 16.32,4.1; 149 16.62,-4.1; 150 16.92,4.1; 151 17.22,-4.1; 152 17.52,4.1; 153 17.82,-4.1; 154 18.12,4.1; 155 18.42,-4.1; 156 18.72,4.1; 157 19.02,-4.1; 158 19.32,4.1; 159 19.62,-4.1; 160 19.92,4.1; 161 20.22,-4.1; 162 20.52,4.1; 163 20.82,-4.1; 164 21.12,4.1; 165 21.42,-4.1; 166 21.72,4.1; 167 22.02,-4.1; 168 22.32,4.1; 169 22.62,-4.1; 170 22.92,4.1; 171 23.22,-4.1; 172 23.52,4.1; 173 23.82,-4.1; 174 24.12,4.1; 175 24.42,-4.1; 176 24.72,4.1; 177 25.02,-4.1; 178 25.32,4.1; 179 25.62,-4.1; 180 25.92,4.1; 181 26.22,-4.1; 182 26.52,4.1; 183 26.82,-4.1; 184 27.12,4.1; 185 27.42,-4.1; 186 27.72,4.1; 187 28.02,-4.1; 188 28.32,4.1; 189 28.62,-4.1; 190 28.92,4.1; 191 29.22,-4.1; 192 29.52,4.1; 193 29.82,-4.1; 194 30.12,4.1; 195 30.42,-4.1; 196 30.72,4.1; 197 31.02,-4.1; 198 31.32,4.1; 199 31.62,-4.1; 200 31.92,4.1 | smd 4.5 x 4.6: M1 -32.28,12; M2 32.82,12 | hole 1.1: -33.13,0 | hole 0.6: 33.67,0
SON45P300X300X80-13N = smd 0.8 x 0.25: 1 -1.5,1.125; 2 -1.5,0.675; 3 -1.5,0.225; 4 -1.5,-0.225; 5 -1.5,-0.675; 6 -1.5,-1.125; 7 1.5,-1.125; 8 1.5,-0.675; 9 1.5,-0.225; 10 1.5,0.225; 11 1.5,0.675; 12 1.5,1.125 | smd 1.75 x 2.65: 13 0,0
MICRO-SD-SOCKET-PP = smd 0.8 x 1.5: 1 -8.94,10.7; 2 -7.84,10.3; 3 -6.74,10.7; 4 -5.64,10.9; 5 -4.54,10.7; 6 -3.44,10.9; 7 -2.34,10.7; 8 -1.24,10.7 | smd 1.8 x 1.4: CD1 -2.05,0.4; CD2 -7.75,0.4 | smd 1.4 x 1.9: GND1 -13.6,14.55; GND3 -0.45,13.55
SC70 = smd 0.4 x 0.75: 1 -0.65,-0.825; 2 0,-0.825; 3 0.65,-0.825; 4 0.65,0.825; 5 -0.65,0.825
HDMI = smd 0.33 x 2.6: 1 11.75,0.75; 2 11.25,0.75; 3 10.75,0.75; 4 10.25,0.75; 5 9.75,0.75; 6 9.25,0.75; 7 8.75,0.75; 8 8.25,0.75; 9 7.75,0.75; 10 7.25,0.75; 11 6.75,0.75; 12 6.25,0.75; 13 5.75,0.75; 14 5.25,0.75; 15 4.75,0.75; 16 4.25,0.75; 17 3.75,0.75; 18 3.25,0.75; 19 2.75,0.75 | drill 2.7: P$20 0,0; P$23 14.5,-0.075 | drill 1.7: P$21 -0.065,-5.96; P$22 14.5,-5.96
CRYSTAL-SMD-5X3 = smd 1.9 x 1.1: 1 -1.85,-1.15; 2 1.85,-1.15; 3 1.85,1.15; 4 -1.85,1.15

### Placement (x,y rotation side)
C1  9.56,100.19 180 top
C2  16.13,97.57 270 top
C3  9.83,97.57 90 top
C4  27.3,43.1 0 top
C6  18.53,97.57 270 top
C7  7.53,97.57 90 top
C8  33.94,102.29 270 top
C9  36.64,99.74 180 top
C10  39.46,102.63 270 top
C11  26.63,97.67 90 top
C12  19.53,76.87 180 top
C13  39.49,95.57 90 top
C14  35.48,95.57 90 top
C15  79.94,97.12 90 top
C16  77.81,104.46 90 top
C17  74.49,101.08 0 top
C18  98.76,78.12 90 top
C19  17.93,87.85 180 top
C45  66.31,36.26 270 top
C46  36.23,38.48 90 top
C47  33.25,43.49 0 top
C48  30.9,28.93 180 top
C49  69.34,31.38 0 top
C50  69.44,40.38 0 top
C51  30.61,25.92 0 top
C52  23.55,28.45 180 top
C53  23.53,25.32 0 top
C54  24.47,47.99 180 top
C55  23.33,43.23 0 top
C56  14.72,28.58 90 top
C57  7.33,28.53 90 top
C58  56.47,2.17 270 top
C59  45.9,38.64 90 top
C60  48.14,38.64 90 top
C61  38.84,33.56 270 top
C62  41.2,33.56 270 top
C63  40.84,27.83 90 top
C64  42.68,27.86 270 top
C65  56.47,6.74 270 top
C66  79.84,32.9 0 top
C67  84.92,24.77 0 top
C68  90.76,24.77 0 top
C69  79.84,30.87 0 top
C70  79.84,26.8 0 top
C71  79.84,28.84 0 top
IC1  56.3,94.52 0 top
IC2  74.56,104.15 270 top
IC4  69.02,35.86 180 top
IC5  TVS-DUAL-BI  [SOT23']  47.78,14.57 180 top
IC6  TVS-DUAL-BI  [SOT23']  24.7,14.52 180 top
IC7  24.08,36.32 270 top
IC8  TVS-DUAL-BI  [SOT23']  69.93,14.61 180 top
IC9  85.68,30.36 0 top
IC15  19.31,80.59 90 top
J1  25.48,6.23 90 top
J6  70.19,6.23 90 top
J7  47.83,6.23 90 top
J8  93.81,30.87 90 top
JP1  9.1,105.5 0 top
JP2  68.8,50.8 180 top
JP3  10.54,80.69 0 top
JP4  37.1,50.7 180 top
JP5  45.7,50.8 0 top
JP6  97.5,50.6 180 top
JP7  79,46.7 180 top
JP8  52.21,28.89 270 bottom
JP9  67.22,20.86 180 bottom
JP10  93.81,18.42 270 top
L1  15.97,102.64 0 top
L2  10.13,92.77 180 top
Q2  69.2,104.3 90 top
Q3  69.2,99.2 270 top
R1  9.52,101.78 180 top
R2  65.86,98.91 90 top
R3  64.82,103.88 270 top
R4  66.47,103.87 270 top
R5  45.6,53.5 0 top
R6  49.2,53.5 0 top
R9  111.16,63.44 180 top  (outside the outline)
R10  111.16,64.91 180 top  (outside the outline)
R11  18.06,47.7 90 top
R12  73.31,98.91 0 top
R13  60.25,46.03 0 top
R14  98.16,88.32 180 top
R15  98.21,85.72 180 top
R16  64.33,93.93 270 top
R17  67.01,93.93 270 top
R18  16.34,44.32 90 top
R19  20.09,43.09 90 top
R20  59.01,2.17 270 top
R21  7.56,23.11 180 top
R22  14.09,23.26 0 top
R23  52.72,38.64 90 top
R24  50.48,38.64 270 top
R40  45.82,33.5 270 top
R41  43.56,33.56 90 top
R43  39,27.83 90 top
R44  44.65,27.86 270 top
R45  46.64,27.91 270 top
R47  61.55,2.17 270 top
R49  59.01,6.74 270 top
R52  61.55,6.74 270 top
R53  79.84,34.93 180 top
R54  89.24,20.71 270 top
R55  89.24,17.15 270 top
S1  83.65,2.93 180 top
SODIMM  59.53,85.05 180 top
U1  13.08,97.59 90 top
U2  95.4,92.4 0 top
U3  36.71,102.35 270 top
U4  60.17,99.22 180 top
Y1  32.93,39.49 270 top

### Tracks (layer width: path | path; a pad name or v marks a point on that pad's centre or on a via)
AMP_IN_LEFT+
  Top 0.406: C66.1 75.52,32.9 74,31.38 74,21.22 83.65,11.56
  Top 0.61: 83.65,11.56 S1.2
AVCC_3V3  (via drill 0.4)  (1 unrouted)
  Top 0.305: IC7.14 18.9,32.09 v18.2,31.77 | IC7.8 19.76,35.99 v18.86,36.38
  Top 0.508: C52.+ 19.68,28.47 v19.37,28.78 | C49.+ 71.21,32.5 | 71.21,32.5 70.81,32.91 | 69.97,34.85 IC4.5 69.97,32.97 69.9,32.9 | v65.22,33.76 66.07,32.9 69.9,32.9 | 69.9,32.9 70.81,32.9 71.21,32.5
  Top 0.61: 22.64,25.28 C53.1 22.68,27.98 22.37,28.28 21.86,28.28 C52.+ | 71.26,31.31 C49.+
  Bottom 0.508: 20.6,27.9 20.6,28.8 20.6,31.7 20.6,34.7 18.92,36.38 | v18.2,31.77 20.53,31.77 | v19.37,28.78 20.58,28.78
  Bottom 0.61: 18.92,36.38 v18.86,36.38 | 20.53,31.77 20.6,31.7 | 20.58,28.78 20.6,28.8
BCLK
  Top 0.254: IC7.3 19.55,39.24 19.31,39.48 19.31,41.57 20.02,42.29
  Top 0.305: 20.02,42.29 20.07,42.22 R19.1
CEC  (via drill 0.45)
  Top 0.25: 68.56,103.3 v68.08,102.82
  Top 0.254: U4.13 54.42,93.72 | 54.42,93.72 v54.42,92.58 | IC1.1 54.42,93.72 | Q2.3 68.55,103.31 68.56,103.3
  Bottom 0.25: v68.08,102.82 68.08,100.78 63.24,95.94 59.26,95.94 58.03,94.71 58.03,92.81 57.81,92.58 v54.42,92.58
CM_BCLK  (1 unrouted)
CM_DIN  (1 unrouted)
CM_DOUT  (1 unrouted)
CM_LRCIN  (1 unrouted)
CM_RXD  (via drill 0.35)
  Top 0.254: SODIMM.53 71.71,86.21 v70.9,85.4 | v68.5,55.7 47.3,55.7 46.4,54.8 46.4,53.55 R5.2
  Bottom 0.254: v70.9,85.4 70.9,64 68.5,61.6 v68.5,55.7
CM_SCL  (3 unrouted)
CM_SDA  (3 unrouted)
CM_TXD  (via drill 0.35)
  Top 0.254: SODIMM.51 72.31,86.01 71.8,85.5 v71.8,83.8 | R6.2 51.15,54.6 v68.9,54.6
  Bottom 0.254: v71.8,83.8 71.5,83.5 71.5,60.9 69.4,58.8 69.4,55 69,54.6 v68.9,54.6
CM_VDAC
  Top 0.254: SODIMM.190 30.61,86.71 30.9,87 SODIMM.189 30.91,91.41 32.4,92.9 35.2,92.9 35.5,93.2 35.5,93.98 35.48,94 C14.1
  Top 0.305: C10.1 38.02,103.48 U3.5 38,103 38.5,102.5 38.5,98.6 37.3,97.4 37.3,94.7
  Top 0.406: C14.1 36.77,94.17 37.3,94.7
DIN  (1 unrouted)
DOUT
  Top 0.254: IC7.6 19.06,37.29 17.36,38.99
  Top 0.305: 17.36,38.99 17.36,40.99 16.36,41.99 16.36,43.7 R18.1
GAIN1  (via drill 0.4 pad 0.4)
  Top 0.203: IC9.P$5 82.78,29.96 v82.12,29.85
  Bottom 0.203: v82.12,29.85 82.12,25.79 84.16,23.76 93.55,23.76
  Bottom 0.406: 93.55,23.76 JP10.2 JP10.4 JP10.6 JP10.8
GND  (via drill 0.4, 0.45)
  Top 0.203: U1.9 13.3,97.81 U1.13 12.99,97.5 12.86,97.36 U1.3 | v84.19,27.86 84.7,27.86 85.68,28.58 85.68,29.56 arc90 86.08,29.16 IC9.P$8 | IC9.P$1 84.2,32.92 v84.19,32.94
  Top 0.254: U4.17 56.42,100.98 v56.7,101.26 | U4.11 53.42,99.92 v54.2,100.7 | U4.8 51.92,100.58 v51.9,100.6 | U4.5 50.42,100.52 v50.5,100.6 | U4.2 48.92,100.58 v48.9,100.6
  Top 0.305: IC2.1 73.95,105.1 | R17.1 68.72,94.78 v69,94.5 | R16.1 64.15,94.6 v62.1,94.6 | C15.2 79.94,99.26 v79.9,99.3 | R14.1 99.01,89.61 v99.1,89.7 | R15.1 100.12,85.72 v100.2,85.8 | C18.2 98.76,80.74 v98.7,80.8 | C46.2 36.23,40.65 v36.37,40.78 | IC7.21 25.56,35.99 v25.27,36.28 | IC7.11 22.03,34.04 22.34,34.35 22.34,35.35 v23.27,36.28 | 27.58,40.54 28.9,41.86 28.9,42.91 v29.47,43.48 | IC5.3 46.31,13.47 v45.72,12.89 | IC8.3 68.63,13.51 v68.24,13.12 | C60.1 48.17,37.76 | R44.2 C64.2 | R20.1 v59.01,4.45 | R49.1 59.01,7.75
  Top 0.406: C14.2 34.7,97.75 v34.7,98.6 | C13.2 v39.49,98.59 v39.5,98.6 | C19.1 20.05,87.85 v20.1,87.9 | 15.08,96.73 16.02,96.73 C2.2 C6.2 | C50.- 68.07,40.35 68.56,40.84 v68.56,41.64 | C45.1 66.31,37.99 v66.06,38.24 | C49.- 67.51,30.49 v67.26,30.24 | IC4.2 69.02,36.18 69.36,35.84 v69.56,35.84 | C47.2 34.98,43.49 v35.32,43.58 | C48.- 32.24,28.95 v31.37,28.08 | C51.2 32.63,25.92 v32.67,25.88 | 27.56,32.09 IC7.15 28.26,32.09 28.77,31.58 28.77,30.88 v28.97,30.68 | C52.- 24.48,28.47 v23.77,29.18 | C53.2 24.38,26.57 v24.07,26.88 | R22.1 12.95,23.26 | 36.4,15.61 v36.34,17.19 | 8.58,23.11 R21.1 | IC7.28 27.58,40.54 | 11.65,98.36 11.65,96.89 12.27,97.5 12.99,97.5 | 14.46,98.27 14.46,96.89 14.62,96.73 15.08,96.73 | U1.13 13.06,97.57 v12.53,97.57 | U1.13 13.1,97.57 v13.63,97.57 | U1.13 14.22,97.59 15.08,96.73
  Bottom 0.254: v56.7,101.26 56.7,101.28
  Bottom 0.305: 36.39,40.76 v36.37,40.78
  other vias: 24.63,97.34 18.43,94.97 16.03,94.87 6.77,100.41 32.1,79 34.9,79 40.1,79 44.7,79 49.2,79 72.4,79 68.2,79 63.2,79 56.8,79 40.8,85.1 47,85.1 53.4,85.1 57.1,85.1 68.4,85 72.6,85 77.5,101.8 70.9,101.2 75,96.6 71.7,93.9 60.4,92.6 44.5,91.8 46.9,92.6 35.5,84.7 3.8,100.4 3.1,91.9 3.6,71.8 3.6,64.8 3.6,58.8 19.2,54.2 27.6,58.8 38.6,58.8 47.8,63.3 56.7,68 71.4,55.4 84.3,62.5 84,65.5 65.6,65.8 53.6,65.8 33.6,65.8 97.6,64.8 97.6,58.8 99.6,100 78.7,93.4 97.1,93.2 96.7,82.8 16.9,74.4 20.2,74.4 21.5,83.1 17.5,83.2 15.4,90.5 20.7,90.6 25.4,92.6 22.8,101.7 31.9,99.8 31.4,95.8 27.7,105.4 36.8,105.1 49.5,87.1 51.4,87.2 53.2,87.2 81.8,91.5 85.9,77.1 78.3,78.7 82.4,77 88.9,76.9 79.4,105 21.5,46.4 88.9,50.7 14.2,66.6 97.6,73.4 97.2,106.4 32.71,3.37 53.87,3.37 67.47,3.29 66.71,17.12 73.06,17.23 38.05,3.37 93.33,6.59 20.17,26.18 85.71,27.86 87.23,32.94 83.09,38.53 76.82,29.89 89.27,32.94 89.77,29.89 87.23,27.86 85.71,32.94 76.62,3.29 3.8,51 3.7,38 3.5,24.2 3.6,12.4 12.1,3 84.9,17 41.1,19 92.5,44 99.4,44 73.2,35.9 34.3,46.8 99.43,21.39 99.43,37.29 81.33,19.29
  pour Top (isolate 0.254, rank 2): -1.02,115.29 102.98,115.29 103,-4.6 0,-4.6
  pour Bottom (isolate 0.254): 0.7,116.6 103.7,116.6 103,-3.9 0,-3.9
  pour Route2 (isolate 0.254, rank 2): -1.42,114.49 102.58,114.49 102.6,-5.4 -0.4,-5.4
GPIO5  (via drill 0.35)
  Top 0.254: JP6.2 94.9,50.91 94.9,53.8 88.2,60.4 79,60.4 76.7,62.7 76.7,89.3 77.3,89.9 v77.3,89.8 | v85.5,91.4 86.11,90.79 SODIMM.17
  Bottom 0.254: v77.3,89.8 83.9,89.8 v85.5,91.4
GPIO6  (via drill 0.35)
  Top 0.254: SODIMM.21 84.91,90.59 v84.1,91.4 | v78.5,90.61 78.5,81.1 77.4,80 77.4,63.3 79.5,61.2 89.1,61.2 97.5,52.8 JP6.1
  Bottom 0.254: v84.1,91.4 83.5,91.4 82.7,90.6 v78.5,90.6 v78.5,90.61
H5V
  Top 0.25: 56.92,100.37 58.5,101.95 64.9,101.95 66.5,101.95 | 68.7,102.29 68.36,101.95 66.5,101.95 | R4.2 66.47,101.98 66.5,101.95
  Top 0.254: 73.39,103.27 IC2.2 | IC2.2 73.64,103.02 C17.1 | IC1.4 56.95,98.44 U4.18 56.92,100.37 | R3.2 arc-90 64.9,102.95 64.9,101.95 | IC2.2 69.8,103.2 | 69.8,103.2 69.61,103.2 68.7,102.29 | Q2.1 69.8,103.7 69.8,103.2
HDMI_CEC  (via drill 0.45)
  Top 0.254: SODIMM.171 36.31,90.31 36.6,90.6 40.7,90.6 43.3,93.2 43.3,101.2 43.8,101.7 52.7,101.7 v53.2,101.2 | v69.37,106.21 69.85,105.73 Q2.2
  Top 0.305: 69.42,106.31 v69.37,106.21
  Bottom 0.25: 69.63,106.13 v69.37,106.21
  Bottom 0.254: v53.2,101.2 53.2,102.6 53.8,103.2 56.7,103.2 57.6,102.3 63.7,102.3
  Bottom 0.305: 63.7,102.3 67.61,106.21 v69.37,106.21
HDMI_CK_N
  Top 0.152: 54.01,91.01
  Top 0.254: U4.12 53.92,96.97 53.65,96.7 53.65,91.36 54.01,91.01 54.31,90.71 SODIMM.111
HDMI_CK_P
  Top 0.152: 53.69,90.09 53.7,89.9 SODIMM.113
  Top 0.254: U4.10 52.92,96.93 53.25,96.6 53.25,91.24 53.69,90.79 53.69,90.09
HDMI_D0_N
  Top 0.254: U4.9 52.42,96.87 52.15,96.6 52.15,92.26 52.45,91.96 52.45,90.6 52.51,90.54 SODIMM.117
HDMI_D0_P
  Top 0.152: SODIMM.119
  Top 0.254: U4.7 51.42,96.83 51.75,96.5 51.75,92.14 52.05,91.84 52.05,90.65 51.9,90.5 SODIMM.119
HDMI_D1_N
  Top 0.254: U4.6 50.92,96.87 50.65,96.6 50.65,90.4 50.71,90.34 SODIMM.123
HDMI_D1_P
  Top 0.254: U4.4 49.92,96.83 50.25,96.5 50.25,90.5 50.11,90.36 SODIMM.125
HDMI_D2_N
  Top 0.152: 48.85,89.21 SODIMM.129
  Top 0.254: U4.3 49.42,96.87 49.05,96.5 49.05,93.14 48.85,92.94 48.85,89.21
HDMI_D2_P
  Top 0.254: U4.1 48.42,96.83 48.65,96.6 48.65,93.26 48.45,93.06 48.45,90.5 48.31,90.36 SODIMM.131
HDMI_HPD
  Top 0.25: 68.23,99.76 68,99.76 R2.2 64.93,100.69 64.16,101.49 64.15,101.5 58.92,101.5 57.43,100.01
  Top 0.254: 57.43,100.01 U4.19 57.42,95.99 57.78,95.63 57.78,94 57.5,93.72 IC1.3 | Q3.1 68.01,99.75 68,99.76
HDMI_HPD_N_1V8  (via drill 0.45)
  Top 0.25: v70.54,96.78 70.54,98.9 70.55,98.91
  Top 0.254: 72.44,98.91 70.55,98.91 70.26,99.2 Q3.3 | 72.44,98.91 R12.1 | SODIMM.88 61.21,84.61 v61.7,85.1 | 72.54,98.81 72.44,98.91
  Bottom 0.25: 68.3,95.4 69.7,96.8 70.55,96.8 v70.54,96.79 v70.54,96.78
  Bottom 0.254: v61.7,85.1 63,86.4 63,94.1 64.3,95.4 68.3,95.4
HDMI_SCL
  Top 0.25: 55.4,102.8 55.67,102.8 56.05,103.18 57.81,103.18 58.13,102.86 62.5,102.86 63.35,103.71 63.35,104.59 63.8,105.04 63.8,105.3 64.2,105.7 66.2,105.7 66.47,105.43 R4.1
  Top 0.254: SODIMM.175 35.11,91.11 35.6,91.6 39.7,91.6 42.1,94 42.1,101.9 43,102.8 55.4,102.8 55.4,98.49 U4.15 55.42,96.51 55.65,96.28 IC1.6
HDMI_SDA  (via drill 0.45)
  Top 0.25: v56.3,102.36 56.56,102.1 58.01,102.1 58.31,102.41 62.81,102.41 63.8,103.4 63.8,104.4 64.13,104.73 R3.1
  Top 0.254: SODIMM.173 35.71,90.71 36.1,91.1 40.2,91.1 42.7,93.6 42.7,101.6 43.4,102.3 54,102.3 v54.3,102 | v56.3,102.36 55.92,101.98 U4.16 55.92,96.71 56.3,96.33 IC1.5
  Bottom 0.254: v54.3,102 55.27,102 55.63,102.36 v56.3,102.36
LHPOUT  (2 unrouted)
  Top 0.61: C57.- 6.71,24.62 R21.2 6.71,22.19
LLINEIN  (1 unrouted)
  Top 0.305: 52.8,37.71 R23.1 | IC5.1 50.33,15.67 52.91,15.63 52.91,9.61 J7.2
LOUT
  Top 0.305: R47.1 61.64,2.93 62.57,2.93 62.57,5.21 64.09,6.74 72.73,6.74 74.76,8.77 74.76,9.1 J6.2 75.19,14.44 74,15.63 70.97,15.63 IC8.1 70.88,16.71 69.68,17.91 | JP9.2 69.68,20.78
  Top 0.406: 81.65,4.67 80.6,5.72 73.74,5.72 72.73,6.74
  Top 0.61: 69.68,20.78 69.68,17.91 | 81.65,4.67 S1.3
LOUT-1
  Top 0.203: IC9.P$14 87.9,31.56 88.22,31.88
  Top 0.305: 88.22,31.88 88.73,31.88
  Top 0.61: 88.73,31.88 90.76,31.88 91.27,32.39
  Top 0.813: 91.27,32.39 91.54,32.67 J8.1
LRCIN
  Top 0.254: IC7.5 19.2,37.94 17.96,39.18 17.96,44.98 18.06,45.39 R11.1
  Top 0.305: IC7.5 22.33,37.94 22.56,37.71 22.56,36.95 22.25,36.64 IC7.7
MICIN  (2 unrouted)
  Top 0.305: R44.1 C64.1 40.86,28.71 C63.2
N$1
  Top 0.254: U1.8 13.76,101.75 L1.1
N$2
  Top 0.203: U1.12 11.51,99.09 C1.1
  Top 0.254: R1.1 10.41,101.74 C1.1
N$3
  Top 0.254: R5.1 44.8,53.45 44.8,52.3 45.7,51.4 JP5.1
N$4
  Top 0.254: R6.1 48.24,53.39 JP5.2
N$5
  Top 0.2: 12.4,93.22 L2.1
  Top 0.254: U1.2 12.4,93.22
N$7
  Top 0.305: U3.4 37.49,101.66 C9.1
N$8  (via drill 0.45)
  Top 0.254: SODIMM.84 62.41,82.29 61.9,82.8 61.9,83.7 v62.4,84.2 | v64.3,91.5 64.3,93.05 R16.2
  Bottom 0.254: v62.4,84.2 64.3,86.1 v64.3,91.5
N$9
  Top 0.254: R15.2 96.38,85.72 96.1,85.8 94,85.8 93.3,86.5 90,86.5 89,85.5 83.9,85.5 82.8,84.4 82.81,84.39 SODIMM.28
N$10
  Top 0.254: R14.2 95.29,86.3 94.3,86.3 93.6,87 89.7,87 88.7,86 83.5,86 82.2,84.7 SODIMM.30
N$11  (via drill 0.45)
  Top 0.254: R17.2 67.01,91.69 v67.1,91.6 | SODIMM.82 63.01,83.09 v63,83.2
  Bottom 0.254: v67.1,91.6 67.1,87.3 v63,83.2
N$38
  Top 0.305: IC4.4 67.16,34.56 C45.2
N$39  (1 unrouted)
  Top 0.305: IC7.25 30.59,38.59 | 33.58,39.48 33.88,39.18 33.88,37.84 Y1.3 36.22,37.64 C46.1
N$40  (1 unrouted)
  Top 0.305: IC7.26 30.24,39.24 | 31.58,40.58 31.83,41.14 Y1.1 31.78,42.88 C47.1
N$45
  Top 0.254: IC7.16 29.01,32.74 29.47,32.28 29.47,31.68 30.27,30.88 30.27,29.48 29.97,29.18 29.6,29.18 29.37,28.95 C48.+
  Top 0.305: C51.1 29.63,25.92 29.07,26.48 29.07,28.91 C48.+
N$46
  Top 0.305: R23.2 R24.1 C60.2 C59.2
N$47  (1 unrouted)
  Top 0.305: 56.38,2.93 C58.1 53.51,5.72 38.69,5.72 36.41,8
N$48  (1 unrouted)
  Top 0.305: 7.54,31.46 C57.+
  Top 0.813: 7.36,31.47 C57.+
N$49  (1 unrouted)
N$50
  Top 0.305: R40.2 43.62,32.65 R41.1 43.56,32.77 43.57,32.78 41.27,32.78 C62.2 C61.2
N$51  (1 unrouted)
  Top 0.305: 45.88,37.81 C59.1 45.78,37.68
N$52  (1 unrouted)
  Top 0.305: 38.81,34.38 C61.1
N$53  (1 unrouted)
  Top 0.305: 38.91,28.6 R43.2
N$54
  Top 0.305: R43.1 C63.1
N$55  (1 unrouted)
N$58
  Top 0.305: C58.2 R20.2 R47.2
N$59
  Top 0.305: C65.2 R49.2 R52.2
N$60  (1 unrouted)
  Top 0.305: 37.06,8.37 38.94,6.48 54.44,6.48 55.71,7.75 56.3,7.75 C65.1
N$61
  Top 0.406: JP10.1 90.76,22.23 90.25,21.72 89.4,21.72 R54.1
N$62
  Top 0.406: R55.2 91.69,16.3 JP10.5
N$63
  Top 0.203: IC9.P$3 83.25,30.76 82.38,31.63 82.38,32.39 81.87,32.9 C66.2
N$64
  Top 0.203: IC9.P$13 88.18,31.16 88.47,30.87
  Top 0.305: 88.47,30.87 88.98,30.87
  Top 0.61: 88.98,30.87 90.51,30.87 91.27,30.11
  Top 0.813: 91.27,30.11 92.21,29.17 J8.2
N$65
  Top 0.203: IC9.P$2 83.61,31.16 82.89,31.88 82.89,34.68 82.63,34.93 R53.1
N$66
  Top 0.203: IC9.P$4 82.89,30.36 82.38,30.87 C69.2
N$67
  Top 0.203: IC9.P$7 83.72,29.16 82.89,28.33 82.89,27.31 82.38,26.8 C70.2
N$68
  Top 0.203: IC9.P$6 83.36,29.56 82.63,28.84 C71.2
RHPOUT  (2 unrouted)
  Top 0.305: C56.- 14.94,27.93 | R22.2
  Top 0.61: R22.2 14.94,27.93
RLINEIN  (1 unrouted)
  Top 0.305: IC5.2 46.79,15.63 44.53,15.63 42.23,13.33 J7.3 44.22,7.25 54.18,7.25 54.95,8.01 54.95,11.82 53.93,12.83 | R40.1 46.75,34.35
ROUT
  Top 0.305: R52.1 61.72,7.75 61.8,8.01 63.07,9.28 64.54,9.28 | 64.54,9.28 J6.3 | 64.54,9.28 64.54,13.79 66.38,15.63 68.9,15.63 IC8.2 68.98,16.58 67.22,18.34
  Top 0.61: JP9.1 67.22,18.34
SDX_CLK  (via drill 0.4)
  Top 0.254: SODIMM.10 88.21,82.41 88.7,82.9 v89.7,82.9 | v90.9,100.9 90.9,103.06 U2.5
  Bottom 0.254: v89.7,82.9 89.7,87.1 93.1,90.5 93.1,94 89.2,97.9 89.2,99.2 v90.9,100.9
SDX_CMD  (via drill 0.4)
  Top 0.254: SODIMM.12 87.61,82.81 v88.4,83.6 | v88.7,101 88.7,103.06 U2.3
  Bottom 0.254: v88.4,83.6 88.4,86.8 92.3,90.7 92.3,94.1 88.4,98 88.4,100 88.7,100.3 v88.7,101
SDX_D0  (via drill 0.4)
  Top 0.254: SODIMM.16 86.41,83.01 87.8,84.4 89.4,84.4 89.69,84.31 v90.43,84.31 | U2.7 93.06,100.86 v93,100.8
  Bottom 0.254: v93,100.8 93,99.9 93.7,99.2 93.7,90 90.4,86.7 90.4,84.4 90.43,84.37 v90.43,84.31
SDX_D1  (via drill 0.4)
  Top 0.254: SODIMM.18 85.81,83.27 86.83,84.3 87.23,84.68 87.6,85.04 90.56,85.04 v91.26,85.74 91.4,85.8 | v94.2,100.8 94.16,100.84 U2.8
  Bottom 0.254: v91.26,85.74 91.26,86.66 93.5,88.9 94.2,89.59 v94.2,100.8
SDX_D2  (via drill 0.4)
  Top 0.254: SODIMM.22 84.61,83.11 v85.2,83.7 | v86.5,100.9 86.46,100.84 U2.1
  Bottom 0.254: v85.2,83.7 85.37,83.87 85.37,85.5 86.4,86.54 86.4,86.5 91,91.1 91,93.8 85.8,99 85.8,100.2 v86.5,100.9
SDX_D3  (via drill 0.4)
  Top 0.254: SODIMM.24 84.01,83.91 84.7,84.6 v86.1,84.6 | v87.6,101 87.6,102.66 U2.2
  Bottom 0.254: v86.1,84.6 87.6,86.1 87.6,86.9 91.6,90.9 91.6,94 87.6,98 v87.6,101
TV_DAC  (via drill 0.4)
  Top 0.254: SODIMM.166 v37.81,79.01 v37.8,79
  Bottom 0.254: v37.8,79 37.8,61.4 36.9,60.5 36.9,56.5 38.4,55 38.4,50.73 JP4.1
USB_DM  (via drill 0.45)
  Top 0.254: JP3.D- 17.86,81.69 IC15.4 18.34,81.54 19,82.2 19,84.8 v20.8,86.6 | v37.5,86.9 SODIMM.167
  Bottom 0.406: v20.8,86.6 37.2,86.6 v37.5,86.9
USB_DP  (via drill 0.45)
  Top 0.254: JP3.D+ 17.96,79.69 IC15.6 18.74,79.64 19.5,80.4 19.5,83.7 v21.4,85.6 | SODIMM.165 38.11,87.49 38.3,87.3 v38.3,86
  Bottom 0.406: v21.4,85.6 21.8,86 v38.3,86
VCC_1V8  (via drill 0.35)
  Top 0.25: R12.2 77.71,98.91 80.2,101.4 80.2,105.9 79.13,106.97 64.83,106.97 63.35,105.49 63.35,105.23 62.89,104.78 62.89,103.89 62.31,103.31 58.31,103.31 58,103.63 55.86,103.63 55.48,103.25 42.81,103.25 41.1,101.54 41.1,100.88
  Top 0.254: SODIMM.184 | SODIMM.183 32.71,87.31 32.6,87.2 32.4,87 32.11,87.29 SODIMM.185 | U1.10 12.86,102.44 12.33,102.97 6.43,102.97 5.63,102.17 5.63,97.37 6.38,96.62 C7.1 | 8.61,93.27 L2.2
  Top 0.305: SODIMM.186 31.81,82.51 32.1,82.8 | 32.4,82.8 SODIMM.184 | 41.1,100.88 41.1,94.8 41.2,94.7 | 32.1,82.6 32.1,80.76
  Top 0.406: 32.4,87 32.4,82.8 32.1,82.8 32.1,82.6 | 74.04,99.03 R12.2 | 32.6,87.2 32.6,85.1 v33.5,85.1 | v5.3,93.3 8.57,93.3 8.61,93.27
  Top 0.508: 32.4,87 32.4,91.4 33.2,92.2 39.1,92.2 39.49,92.59 C13.1 40.67,94.17 41.2,94.7
  Bottom 0.406: v33.5,85.1 27.34,85.1 26.28,84.04 24.24,84.04 24.2,84 23.43,84.77 21.05,84.77 18.32,87.5 14.2,87.5 11.9,89.8 6.2,89.8 5.3,90.7 v5.3,93.3 5.3,93.4
  pour Top (no thermals): 6.93,97.07 8.63,97.07 8.63,91.47 6.93,91.47
VCC_3V3  (via drill 0.4)  (7 unrouted)
  Top 0.254: SODIMM.192 29.72,81.24 29.7,81.24 SODIMM.194 | 97.45,95.95 101,92.4 101,77.9 100.4,77.3 98.79,77.3 C18.1 | U1.4 13.3,94.19 13.93,93.57 19.93,93.57 20.83,94.47 20.83,97.77 20.08,98.52 C6.1 | SODIMM.193 30,88.86 30.29,89.15 SODIMM.191 | SODIMM.6 89.41,78.49 89.75,78.15 | C18.1 90.63,77.27 89.75,78.15 | SODIMM.4 90.01,78.41 89.75,78.15 | C18.1 | 110.31,64.99 110.27,65.03
  Top 0.305: SODIMM.191 30.31,91.81 31.47,92.97 31.57,92.97 33.92,95.32 33.92,99.55 35.5,101.13 35.5,101.7 | 30.01,79.09 30.2,78.9 30.35,78.75 31.2,77.9 74.3,77.9 75,78.6 SODIMM.42 75,82.8 75.31,83.11 SODIMM.41 75.31,90.91 75.8,91.4 76.87,91.4 | SODIMM.40 79.21,87.01 79.51,87.31 SODIMM.39 79.5,90.9 79,91.4 76.87,91.4 | U3.3 35.5,101.7 | 35.5,101.7 35.3,101.7 35.1,101.9 35.1,102.9 35.2,103 | 35.2,103 U3.1 | 35.2,103 35.06,103.14 C8.1 | 78.48,96.26 76.87,94.67 76.87,91.4 | 28.69,39.89 v29.48,40.68 | 110.32,64.87 R10.2
  Top 0.406: 78.48,96.25 78.48,96.26 78.53,96.27 C15.1 89.7,96.27 | 97.45,95.95 97.13,96.27 89.7,96.27 | 89.7,96.27 89.76,96.33 U2.4 | 110.27,65.03 110.32,64.87 | IC7.27 28.69,39.89
  Top 0.508: 30,88.86 30,83.9 29.7,83.6 29.7,81.24 29.7,79.4 30.2,78.9 | 110.27,63.47 R9.2 | 21.17,42.68 21.17,40.56 IC7.1
  Top 0.813: C6.1 18.53,100.17 18.5,100.2 21.3,100.2 23.1,98.4 23.1,80.9 24.05,79.95 | 24.05,79.95 26.7,77.3 28.9,77.3 30.35,78.75 | C12.1 24.05,79.95
  pour Top (no thermals): 17.43,103.97 19.03,103.97 19.03,98.07 17.43,98.07
VCC_5V  (via drill 0.38, 0.4, 0.45)  (3 unrouted)
  Top 0.203: 88.22,30.11 88.22,30.36 IC9.P$11 IC9.P$12 87.16,30.61 arc90 87.18,30.59 | 87.1,30.56 87.53,30.56 arc90 87.56,30.59
  Top 0.25: U1.6 v14.21,95 v14.2,95
  Top 0.254: SODIMM.198 | IC2.3 77.27,104.15 C16.1 | R1.2 7.02,101.78 7,101.8 v6.9,101.8
  Top 0.305: IC2.3 75.66,105.34 v75.6,105.6 | 27.9,81.24 SODIMM.200 28.19,80.95 SODIMM.198 | SODIMM.197 28.35,89.15 28.2,89 28.06,89 SODIMM.199
  Top 0.406: 87.71,24.75 87.97,24.5 87.97,20.2 88.31,19.86 R54.2 90.85,19.86 91.01,19.69 JP10.3 | R53.2 77.3,34.93 76.03,36.2 v76.03,37.47
  Top 0.61: 69.97,38.74 IC4.1 | 69.97,38.74 69.97,39.95 70.36,40.34 71.29,40.34 C50.+ 76.1,40.35 | IC4.3 68.07,38.35 | 68.07,38.35 68.56,38.84 v68.96,38.84 69.87,38.84 69.97,38.74 | 68.07,38.35 67.65,38.35 v67.26,38.74 | 87.1,30.56 87.76,30.56 88.22,30.11 88.98,29.34 v88.98,28.33 | C67.+ 87.71,24.75 89.89,24.75 C68.1 88.73,24.77 88.73,25.79 88.98,26.04 v88.98,27.31 89.47,27.8 91.2,27.8 92.2,26.8 95,26.8 96.6,28.4 96.6,34.6 94.9,36.3 89.1,36.3 83.1,42.3 | 76.1,40.35 81.15,40.35 | 3.2,56.8 1.6,58.4 1.6,101.6 2.6,102.6 4.4,102.6 5.8,104 5.8,107.2 6.19,107.59 9.8,107.59 10.37,107.02 JP1.2 | v76.03,37.47 76.03,40.28 76.1,40.35
  Top 0.813: 28.2,94.73 28.2,89 28.2,84.8 27.9,84.5 27.9,81.24
  Top 1.016: C11.1 28.2,94.73 29.2,95.73 29.2,102 | v29.2,103.3 29.2,102 | JP1.2 23.6,105.5 27.1,102 29.2,102 | 88.98,27.06 v88.98,27.31 v88.98,28.33
  Bottom 0.25: v14.2,95 12.5,95 12.2,95.3 v11.3,95.3
  Bottom 0.254: v6.9,101.8 6.9,103
  Bottom 0.305: v75.6,105.6 71.09,105.6 69.69,106.99 58.11,106.99 58.1,107 32.9,107
  Bottom 0.406: 6.9,103 10.37,103
  Bottom 0.508: 32.9,107 v29.2,103.3
  Bottom 0.61: v67.26,38.74 68.56,37.44 68.56,37.54 68.96,37.94 v68.96,38.84
  Bottom 1.016: v11.3,95.3 v10.2,95.3 10.37,95.47 10.37,103 JP1.2 14,105.5 15.7,103.8 15.7,99.9 15.6,99.8 15.5,99.9 v15,99.9 v16.3,99.9
  pour Top (no thermals): 9.63,96.67 11.23,96.67 11.53,96.37 11.93,96.37 11.93,94.87 9.63,94.87
  pour Top (no thermals): 14.23,98.87 14.23,100.27 16.83,100.27 16.83,98.37 15.13,98.37 14.73,98.77 14.33,98.77
VCC_USB0
  Top 0.254: JP3.VBUS 16.59,84.19 17.1,84.7 17.1,87.83 C19.2

### Text on the board
tPlace: GND | VIN | GND | TV | GND | DOT | DIN | LRC | BCK | SCL | SCA | GND | GND | GND | GND | GPIO6 | GPIO5 | RXD | TXD | 5V | GND | R | L | GND | GND | MIC | LINE IN | LINE OUT | HP